# EAGLE design TCC (EAGLE 9.3.0)

## Sheet 1 of 6
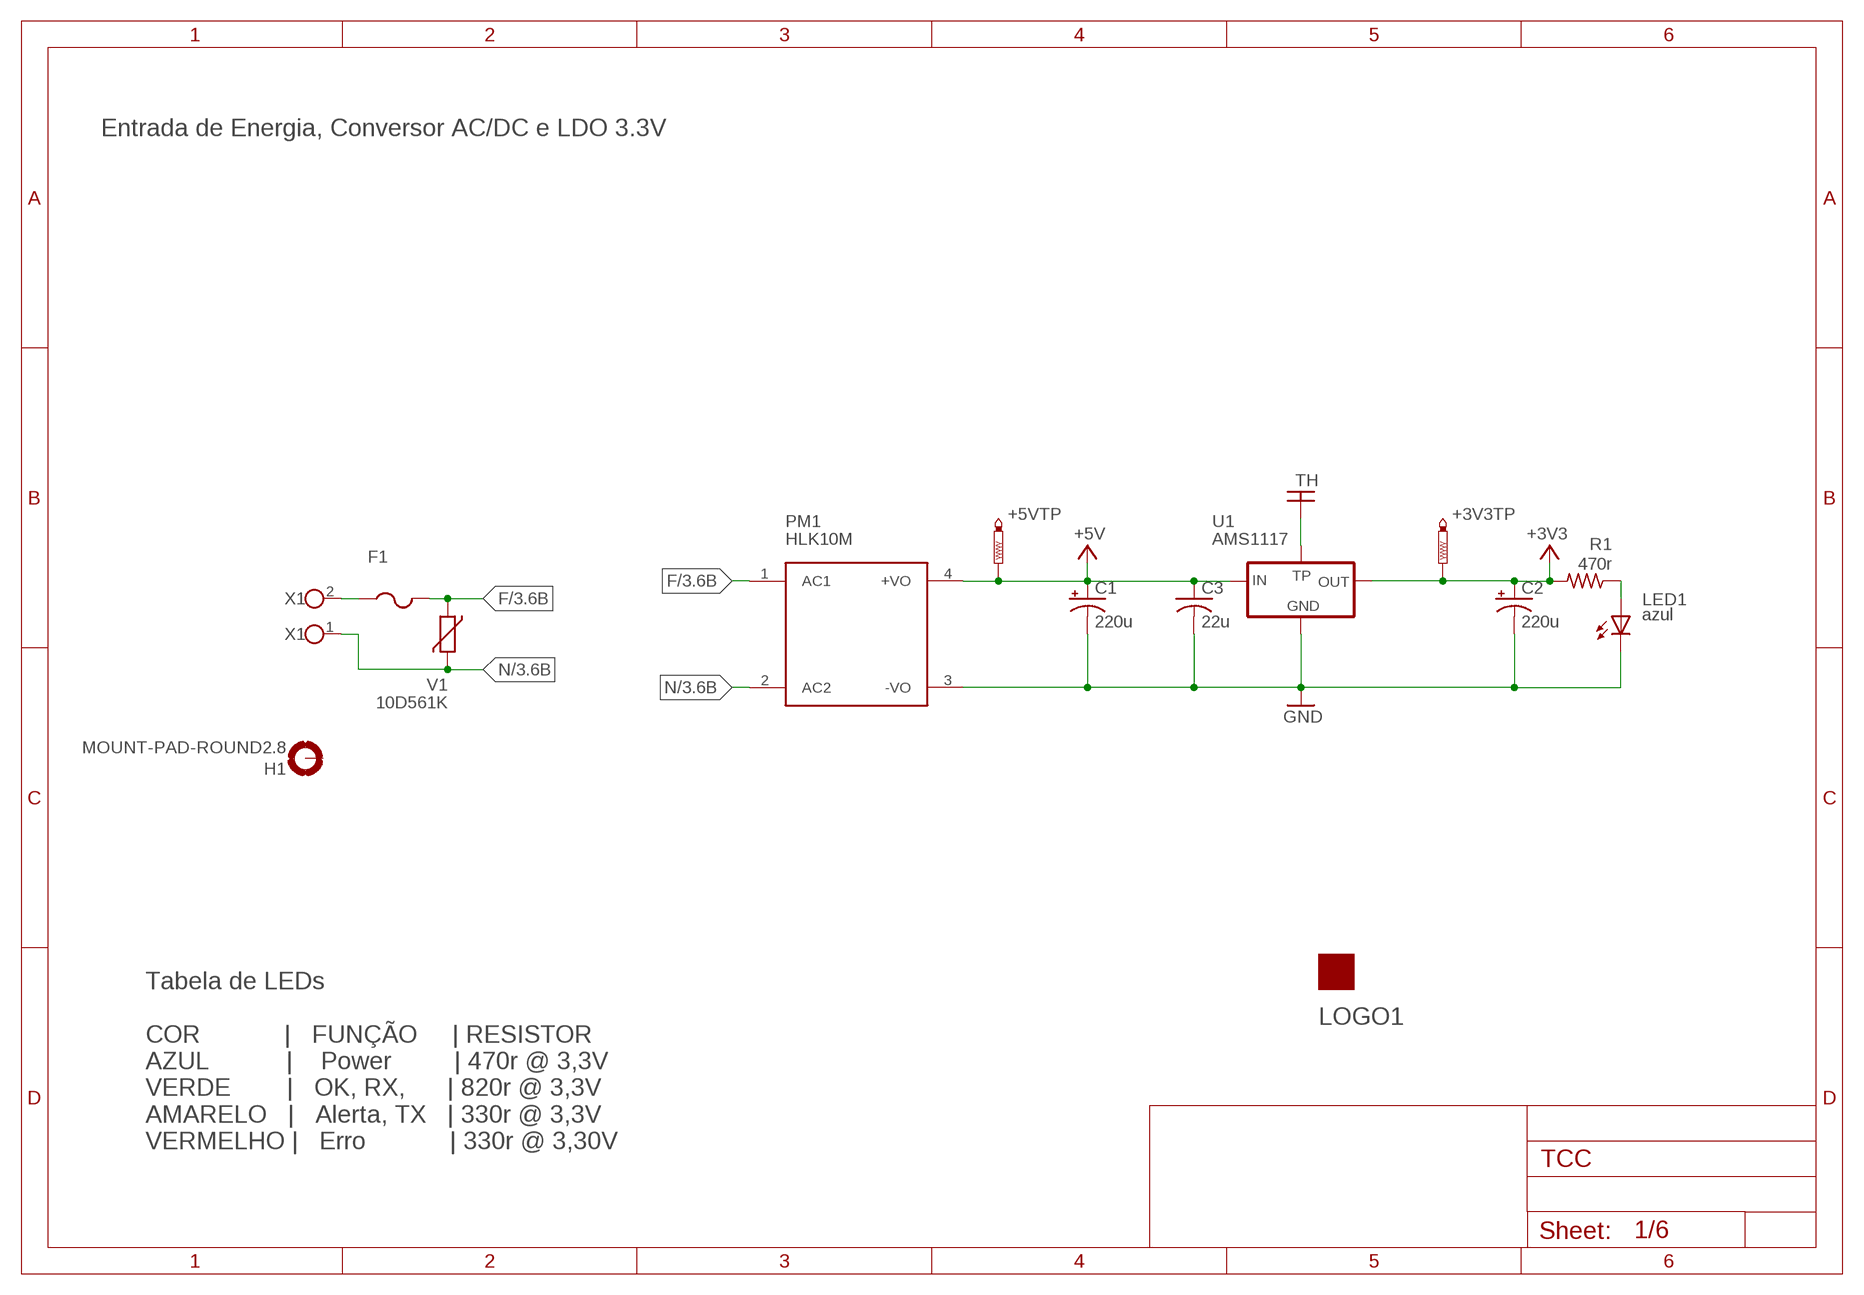
[diagram p0: schematic, sheet 1]

### Parts
+3V3TP  PTR1TP18R  [TP18R]
+5VTP  PTR1TP18R  [TP18R]
C1  220u  CPOL3.5/8  [E3,5-8]
C2  220u  CPOL3.5/8  [E3,5-8]
C3  22u  C0805  [C0805]
F1  FUSE  [SHK20L]
H1  MOUNT-PAD-ROUND2.8  [2,8-PAD]
LED1  azul  LED3MM  [LED3MM]
LOGO1  LOGOLOGO1  [LOGO_BRAZIL_FLAG]
PM1  HLK10M  [HLK-10M]
R1  470r  R0805  [R0805]
U1  AMS1117  [SOT223]
V1  10D561K  VARISTOR  [10D561K]
X1  TERM_BLOCK_2PBR1002V  [BR1002V]

### Nets
+3V3: +3V3TP.TP C2.+ R1.2 U1.2(OUT) ; also sheet 2,3,4,5,6
+5V: +5VTP.TP C1.+ C3.1 PM1.4(+VO) U1.3(IN) ; also sheet 3,6
F: F1.2A F1.2B PM1.1(AC1) V1.1 ; also sheet 3
GND: C1.- C2.- C3.2 LED1.K(C) PM1.3(-VO) U1.1(GND) ; also sheet 2,3,4,5,6
N: PM1.2(AC2) V1.2 X1.1 ; also sheet 3
N$1: F1.1A F1.1B X1.2
N$50: LED1.A R1.1
TH: U1.4(TP)
Unconnected: H1.B2,8(MOUNT)

### Notes on the sheet
- Entrada de Energia, Conversor AC/DC e LDO 3.3V
- Tabela de LEDs
  
  COR            |   FUNÇÃO     | RESISTOR
  AZUL           |    Power         | 470r @ 3,3V
  VERDE        |   OK, RX,      | 820r @ 3,3V
  AMARELO   |   Alerta, TX   | 330r @ 3,3V
  VERMELHO |   Erro            | 330r @ 3,30V

## Sheet 2 of 6
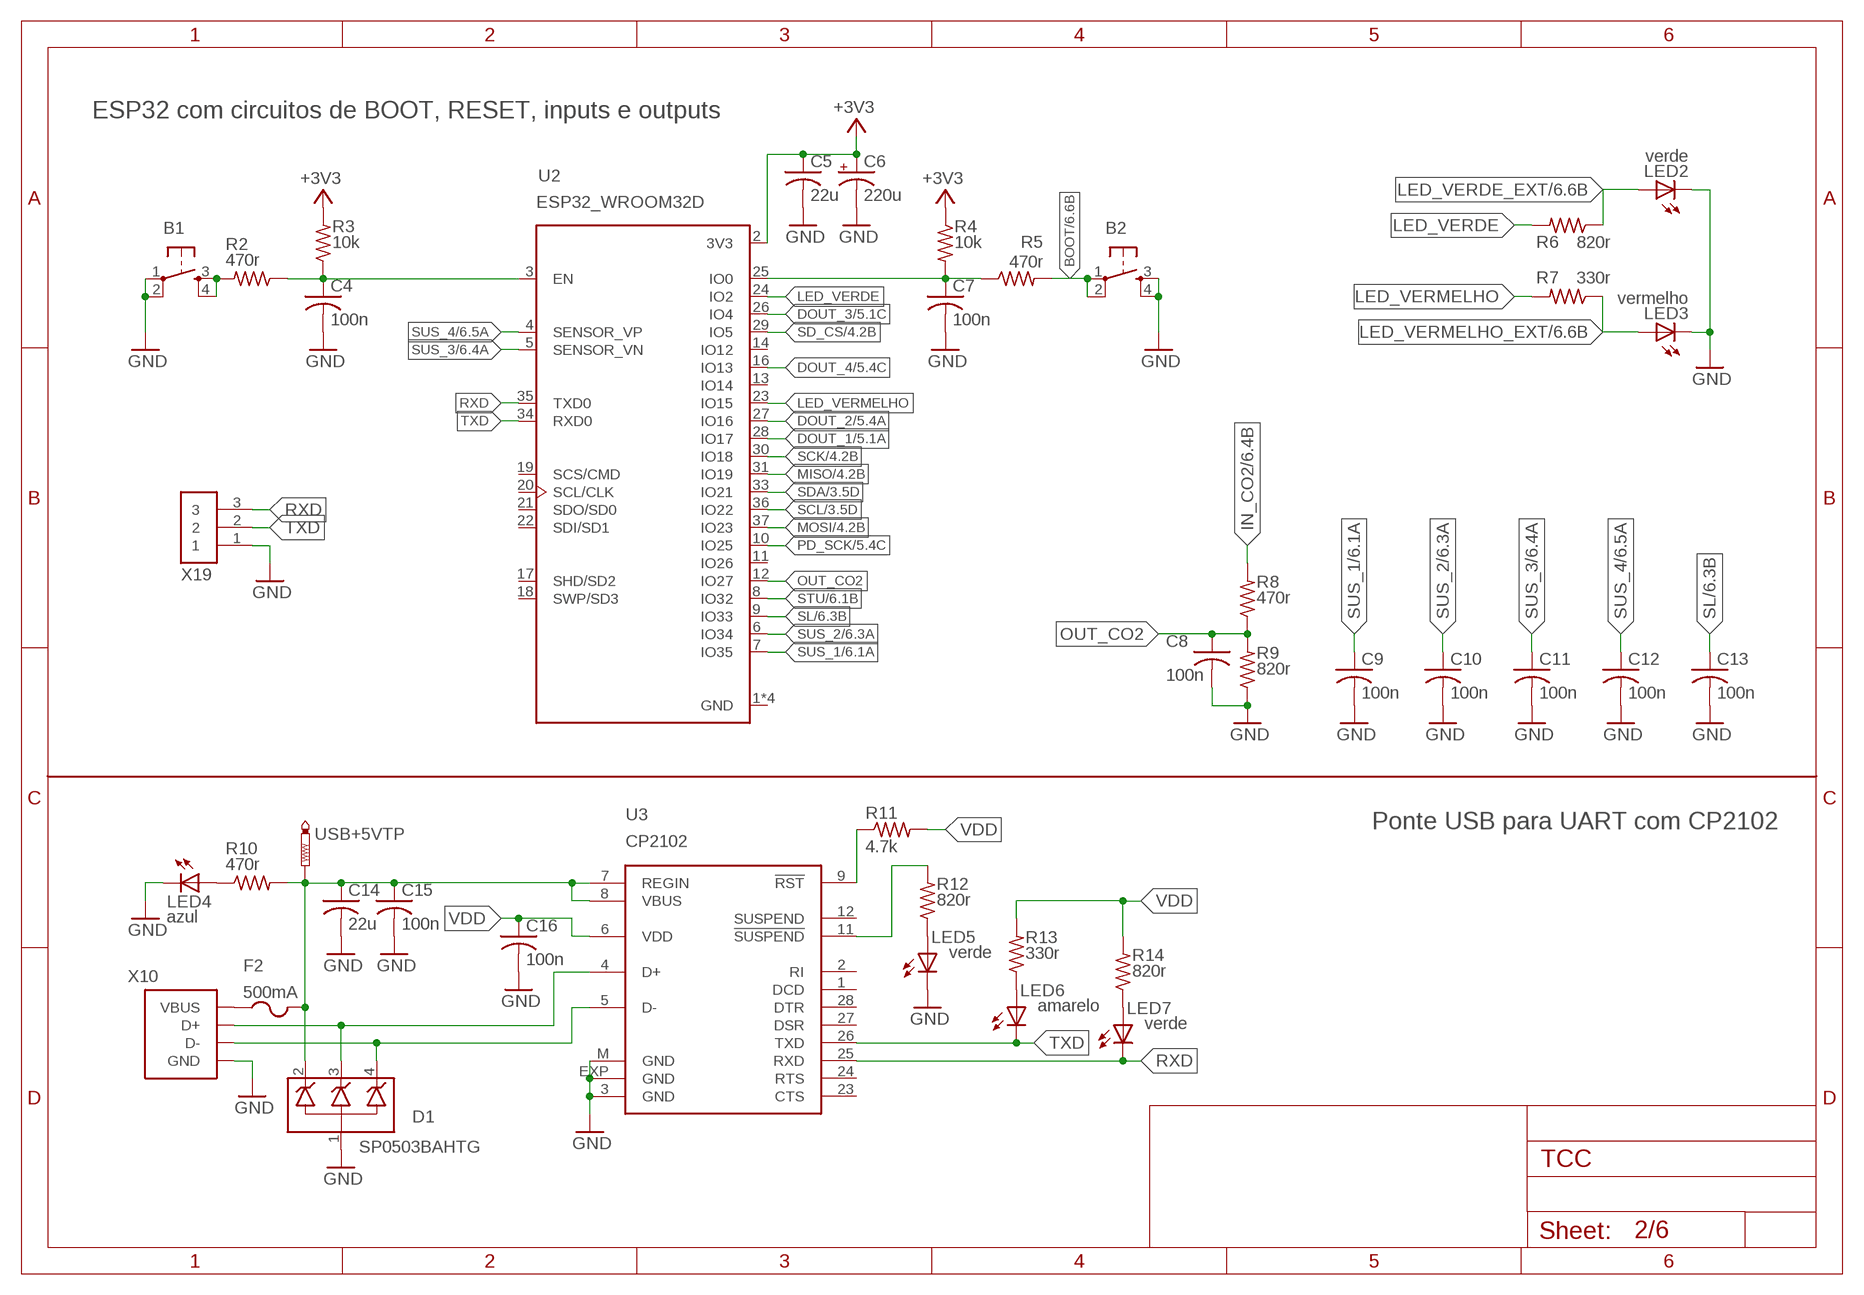
[diagram p1: schematic, sheet 2]

### Parts
B1  PUSHBUTTONTHT  [B3F-10XX]
B2  PUSHBUTTONTHT  [B3F-10XX]
C4  100n  C0805  [C0805]
C5  22u  C0805  [C0805]
C6  220u  CPOL3.5/8  [E3,5-8]
C7  100n  C0805  [C0805]
C8  100n  C0805  [C0805]
C9  100n  C0805  [C0805]
C10  100n  C0805  [C0805]
C11  100n  C0805  [C0805]
C12  100n  C0805  [C0805]
C13  100n  C0805  [C0805]
C14  22u  C0805  [C0805]
C15  100n  C0805  [C0805]
C16  100n  C0805  [C0805]
D1  SP0503BAHTG  TVS_3ARRAY  [SOT-143]
F2  500mA  PTC  [C0603]
LED2  verde  LED3MM  [LED3MM]
LED3  vermelho  LED3MM  [LED3MM]
LED4  azul  LED3MM  [LED3MM]
LED5  verde  LED3MM  [LED3MM]
LED6  amarelo  LED3MM  [LED3MM]
LED7  verde  LED3MM  [LED3MM]
R2  470r  R0805  [R0805]
R3  10k  R0805  [R0805]
R4  10k  R0805  [R0805]
R5  470r  R0805  [R0805]
R6  820r  R0805  [R0805]
R7  330r  R0805  [R0805]
R8  470r  R0805  [R0805]
R9  820r  R0805  [R0805]
R10  470r  R0805  [R0805]
R11  4.7k  R0805  [R0805]
R12  820r  R0805  [R0805]
R13  330r  R0805  [R0805]
R14  820r  R0805  [R0805]
U2  ESP32_WROOM32D  [MODULE_ESP32-WROOM]
U3  CP2102  [MLP28]
USB+5VTP  PTR1TP18R  [TP18R]
X10  USB_TYPEB_V  [USB-TYPEB-V]
X19  1X3  [1X3]

### Nets
+3V3: C5.1 C6.+ R3.2 R4.1 U2.2(3V3) ; also sheet 1,3,4,5,6
BOOT: B2.1 B2.2 R5.2 ; also sheet 6
DOUT_1: U2.28(IO17) ; also sheet 5
DOUT_2: U2.27(IO16) ; also sheet 5
DOUT_3: U2.26(IO4) ; also sheet 5
DOUT_4: U2.16(IO13) ; also sheet 5
GND: B1.1 B1.2 B2.3 B2.4 C4.2 C5.2 C6.- C7.2 C8.2 C9.2 C10.2 C11.2 C12.2 C13.2 C14.2 C15.2 C16.2 D1.1 LED2.K(C) LED3.K(C) LED4.K(C) LED5.K(C) R9.1 U3.3(GND) U3.EXP(GND) U3.M(GND) X10.GND X10.GND@1(GND) X10.GND@2(GND) X19.1 ; also sheet 1,3,4,5,6
IN_CO2: R8.2 ; also sheet 6
LED_VERDE: R6.2 U2.24(IO2)
LED_VERDE_EXT: LED2.A R6.1 ; also sheet 6
LED_VERMELHO: R7.2 U2.23(IO15)
LED_VERMELHO_EXT: LED3.A R7.1 ; also sheet 6
MISO: U2.31(IO19) ; also sheet 4
MOSI: U2.37(IO23) ; also sheet 4
N$5: C4.1 R2.1 R3.1 U2.3(EN)
N$11: B1.3 B1.4 R2.2
N$15: C7.1 R4.2 R5.1 U2.25(IO0)
N$21: C14.1 C15.1 D1.2 F2.2 R10.2 U3.7(REGIN) U3.8(VBUS) USB+5VTP.TP
N$30: LED4.A R10.1
N$36: F2.1 X10.VCC(VBUS)
N$42: R11.1 U3.9(!RST)
N$43: D1.3 U3.4(D+) X10.D+
N$46: D1.4 U3.5(D-) X10.D-
N$49: LED6.A R13.1
N$52: LED7.A R14.1
N$53: LED5.A R12.1
N$54: R12.2 U3.11(!SUSPEND)
OUT_CO2: C8.1 R8.1 R9.2 U2.12(IO27)
PD_SCK: U2.10(IO25) ; also sheet 5
RXD: LED7.K(C) U2.35(TXD0) U3.25(RXD) X19.3
SCK: U2.30(IO18) ; also sheet 4
SCL: U2.36(IO22) ; also sheet 3,4
SD_CS: U2.29(IO5) ; also sheet 4
SDA: U2.33(IO21) ; also sheet 3,4
SL: C13.1 U2.9(IO33) ; also sheet 6
STU: U2.8(IO32) ; also sheet 6
SUS_1: C9.1 U2.7(IO35) ; also sheet 6
SUS_2: C10.1 U2.6(IO34) ; also sheet 6
SUS_3: C11.1 U2.5(SENSOR_VN) ; also sheet 6
SUS_4: C12.1 U2.4(SENSOR_VP) ; also sheet 6
TXD: LED6.K(C) U2.34(RXD0) U3.26(TXD) X19.2
VDD: C16.1 R11.2 R13.2 R14.2 U3.6(VDD)
Unconnected: U2.11(IO26) U2.13(IO14) U2.14(IO12) U2.17(SHD/SD2) U2.18(SWP/SD3) U2.19(SCS/CMD) U2.20(SCL/CLK) U2.21(SDO/SD0) U2.22(SDI/SD1) U3.1(DCD) U3.2(RI) U3.12(SUSPEND) U3.23(CTS) U3.24(RTS) U3.27(DSR) U3.28(DTR)

### Notes on the sheet
- ESP32 com circuitos de BOOT, RESET, inputs e outputs
- Ponte USB para UART com CP2102

## Sheet 3 of 6
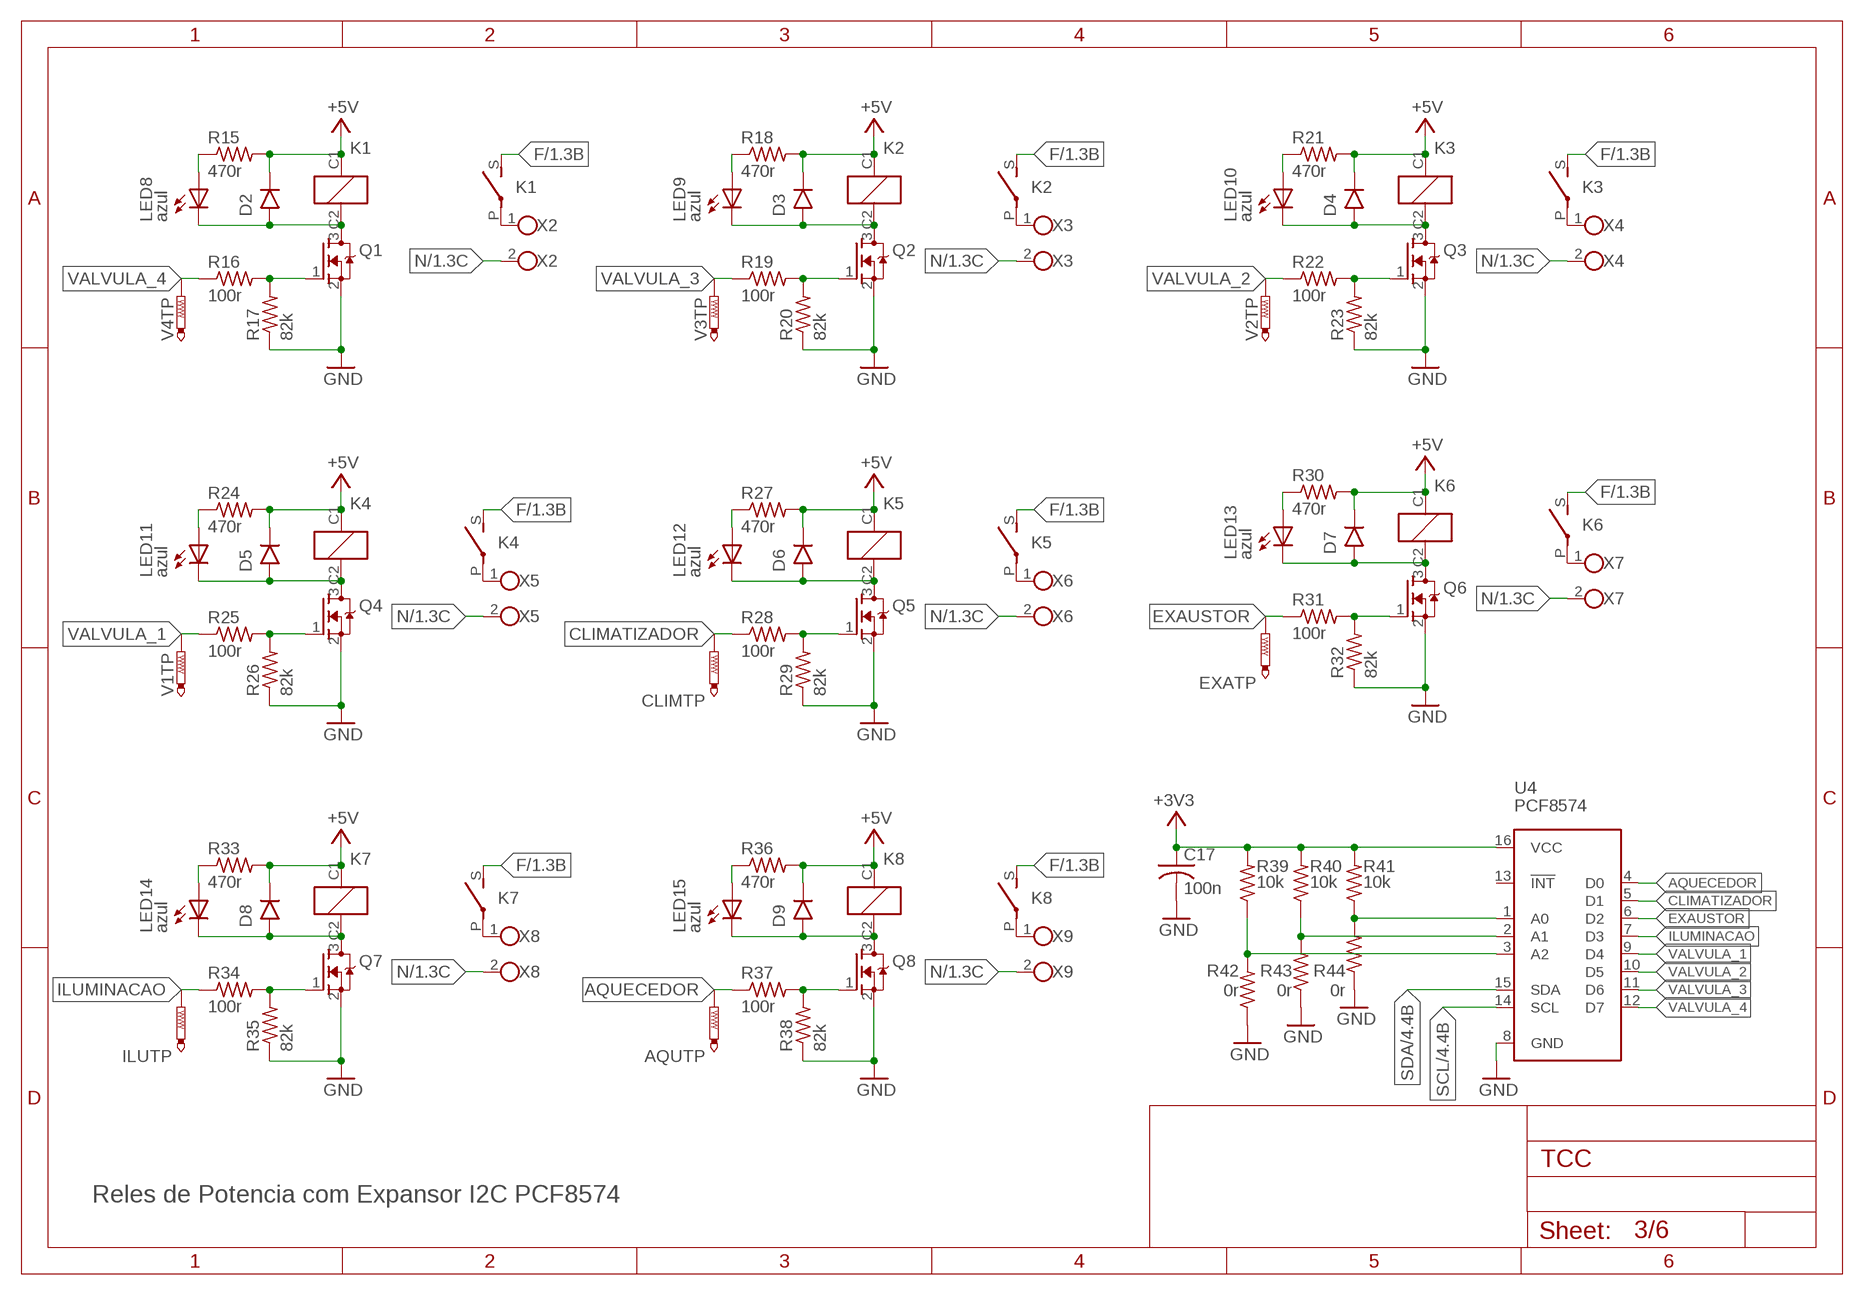
[diagram p2: schematic, sheet 3]

### Parts
AQUTP  PTR1TP18R  [TP18R]
C17  100n  C0805  [C0805]
CLIMTP  PTR1TP18R  [TP18R]
D2  DIODEM7  [SMA]
D3  DIODEM7  [SMA]
D4  DIODEM7  [SMA]
D5  DIODEM7  [SMA]
D6  DIODEM7  [SMA]
D7  DIODEM7  [SMA]
D8  DIODEM7  [SMA]
D9  DIODEM7  [SMA]
EXATP  PTR1TP18R  [TP18R]
ILUTP  PTR1TP18R  [TP18R]
K1  RELAY_SPST  [RC-105]
K2  RELAY_SPST  [RC-105]
K3  RELAY_SPST  [RC-105]
K4  RELAY_SPST  [RC-105]
K5  RELAY_SPST  [RC-105]
K6  RELAY_SPST  [RC-105]
K7  RELAY_SPST  [RC-105]
K8  RELAY_SPST  [RC-105]
LED8  azul  LED3MM  [LED3MM]
LED9  azul  LED3MM  [LED3MM]
LED10  azul  LED3MM  [LED3MM]
LED11  azul  LED3MM  [LED3MM]
LED12  azul  LED3MM  [LED3MM]
LED13  azul  LED3MM  [LED3MM]
LED14  azul  LED3MM  [LED3MM]
LED15  azul  LED3MM  [LED3MM]
Q1  MOSFET-NBSS138  [SOT23]
Q2  MOSFET-NBSS138  [SOT23]
Q3  MOSFET-NBSS138  [SOT23]
Q4  MOSFET-NBSS138  [SOT23]
Q5  MOSFET-NBSS138  [SOT23]
Q6  MOSFET-NBSS138  [SOT23]
Q7  MOSFET-NBSS138  [SOT23]
Q8  MOSFET-NBSS138  [SOT23]
R15  470r  R0805  [R0805]
R16  100r  R0805  [R0805]
R17  82k  R0805  [R0805]
R18  470r  R0805  [R0805]
R19  100r  R0805  [R0805]
R20  82k  R0805  [R0805]
R21  470r  R0805  [R0805]
R22  100r  R0805  [R0805]
R23  82k  R0805  [R0805]
R24  470r  R0805  [R0805]
R25  100r  R0805  [R0805]
R26  82k  R0805  [R0805]
R27  470r  R0805  [R0805]
R28  100r  R0805  [R0805]
R29  82k  R0805  [R0805]
R30  470r  R0805  [R0805]
R31  100r  R0805  [R0805]
R32  82k  R0805  [R0805]
R33  470r  R0805  [R0805]
R34  100r  R0805  [R0805]
R35  82k  R0805  [R0805]
R36  470r  R0805  [R0805]
R37  100r  R0805  [R0805]
R38  82k  R0805  [R0805]
R39  10k  R0805  [R0805]
R40  10k  R0805  [R0805]
R41  10k  R0805  [R0805]
R42  0r  R0805  [R0805]
R43  0r  R0805  [R0805]
R44  0r  R0805  [R0805]
U4  PCF8574  [SOIC16_W]
V1TP  PTR1TP18R  [TP18R]
V2TP  PTR1TP18R  [TP18R]
V3TP  PTR1TP18R  [TP18R]
V4TP  PTR1TP18R  [TP18R]
X2  TERM_BLOCK_2PBR1002V  [BR1002V]
X3  TERM_BLOCK_2PBR1002V  [BR1002V]
X4  TERM_BLOCK_2PBR1002V  [BR1002V]
X5  TERM_BLOCK_2PBR1002V  [BR1002V]
X6  TERM_BLOCK_2PBR1002V  [BR1002V]
X7  TERM_BLOCK_2PBR1002V  [BR1002V]
X8  TERM_BLOCK_2PBR1002V  [BR1002V]
X9  TERM_BLOCK_2PBR1002V  [BR1002V]

### Nets
+3V3: C17.1 R39.2 R40.2 R41.2 U4.16(VCC) ; also sheet 1,2,4,5,6
+5V: D2.C D3.C D4.C D5.C D6.C D7.C D8.C D9.C K1.C1 K2.C1 K3.C1 K4.C1 K5.C1 K6.C1 K7.C1 K8.C1 R15.2 R18.2 R21.2 R24.2 R27.2 R30.2 R33.2 R36.2 ; also sheet 1,6
AQUECEDOR: AQUTP.TP R37.1 U4.4(D0)
CLIMATIZADOR: CLIMTP.TP R28.1 U4.5(D1)
EXAUSTOR: EXATP.TP R31.1 U4.6(D2)
F: K1.S K2.S K3.S K4.S K5.S K6.S K7.S K8.S ; also sheet 1
GND: C17.2 Q1.2(S) Q2.2(S) Q3.2(S) Q4.2(S) Q5.2(S) Q6.2(S) Q7.2(S) Q8.2(S) R17.1 R20.1 R23.1 R26.1 R29.1 R32.1 R35.1 R38.1 R42.1 R43.1 R44.1 U4.8(GND) ; also sheet 1,2,4,5,6
ILUMINACAO: ILUTP.TP R34.1 U4.7(D3)
N: X2.2 X3.2 X4.2 X5.2 X6.2 X7.2 X8.2 X9.2 ; also sheet 1
N$2: D2.A K1.C2 LED8.K(C) Q1.3(D)
N$3: LED8.A R15.1
N$4: Q1.1(G) R16.2 R17.2
N$6: K8.P X9.1
N$7: D3.A K2.C2 LED9.K(C) Q2.3(D)
N$8: Q2.1(G) R19.2 R20.2
N$9: LED9.A R18.1
N$10: K1.P X2.1
N$12: D4.A K3.C2 LED10.K(C) Q3.3(D)
N$13: Q3.1(G) R22.2 R23.2
N$14: LED10.A R21.1
N$16: K2.P X3.1
N$17: D5.A K4.C2 LED11.K(C) Q4.3(D)
N$18: Q4.1(G) R25.2 R26.2
N$19: LED11.A R24.1
N$20: K3.P X4.1
N$22: D6.A K5.C2 LED12.K(C) Q5.3(D)
N$23: Q5.1(G) R28.2 R29.2
N$24: LED12.A R27.1
N$25: K4.P X5.1
N$27: D7.A K6.C2 LED13.K(C) Q6.3(D)
N$28: Q6.1(G) R31.2 R32.2
N$29: LED13.A R30.1
N$31: K5.P X6.1
N$32: D8.A K7.C2 LED14.K(C) Q7.3(D)
N$33: Q7.1(G) R34.2 R35.2
N$34: LED14.A R33.1
N$35: K6.P X7.1
N$37: D9.A K8.C2 LED15.K(C) Q8.3(D)
N$38: Q8.1(G) R37.2 R38.2
N$39: LED15.A R36.1
N$40: K7.P X8.1
N$58: R41.1 R44.2 U4.1(A0)
N$59: R40.1 R43.2 U4.2(A1)
N$60: R39.1 R42.2 U4.3(A2)
SCL: U4.14(SCL) ; also sheet 2,4
SDA: U4.15(SDA) ; also sheet 2,4
VALVULA_1: R25.1 U4.9(D4) V1TP.TP
VALVULA_2: R22.1 U4.10(D5) V2TP.TP
VALVULA_3: R19.1 U4.11(D6) V3TP.TP
VALVULA_4: R16.1 U4.12(D7) V4TP.TP
Unconnected: U4.13(!INT)

### Notes on the sheet
- Reles de Potencia com Expansor I2C PCF8574

## Sheet 4 of 6
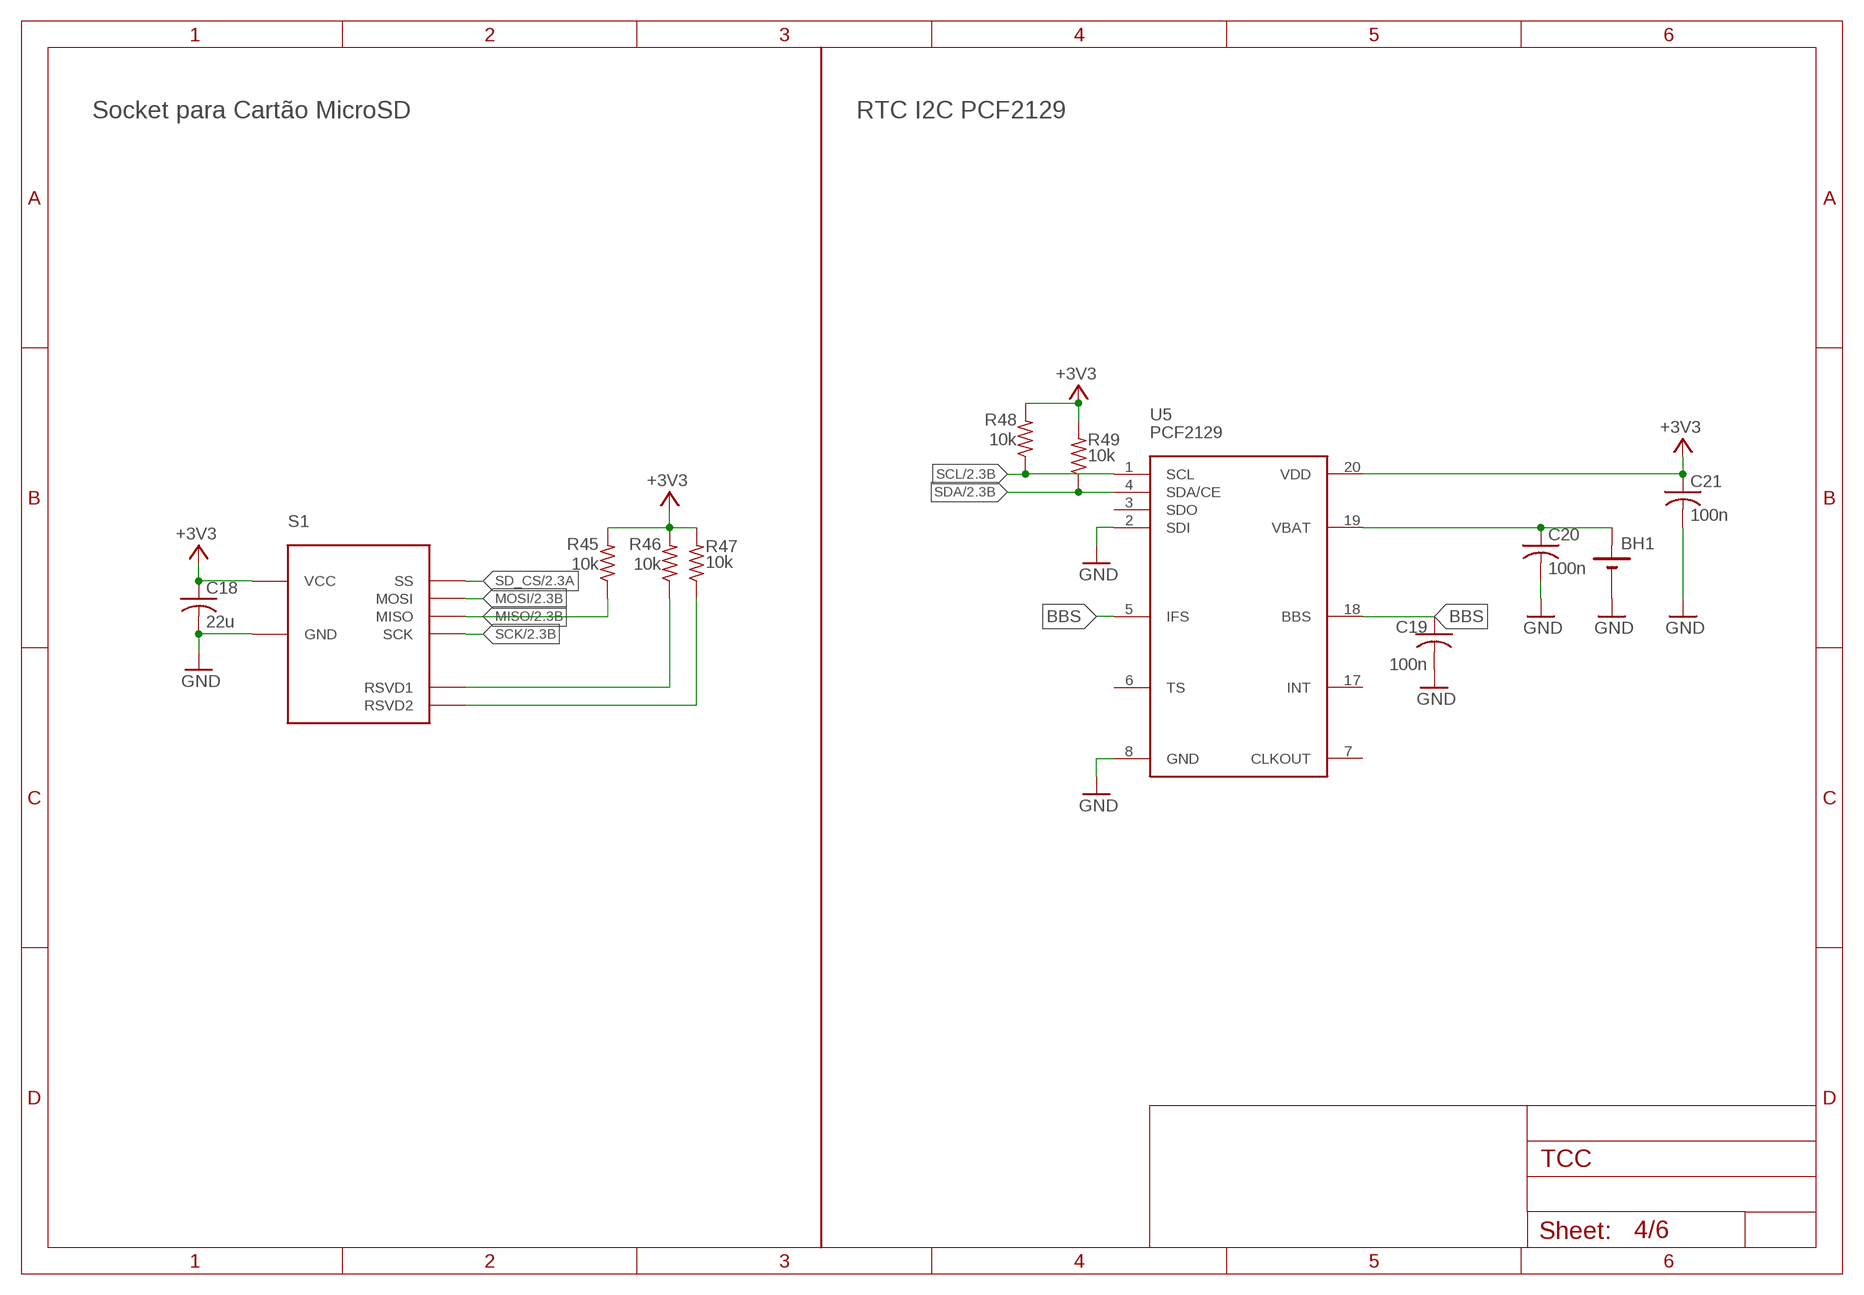
[diagram p3: schematic, sheet 4]

### Parts
BH1  CR2032  [BAT_BS-7]
C18  22u  C0805  [C0805]
C19  100n  C0805  [C0805]
C20  100n  C0805  [C0805]
C21  100n  C0805  [C0805]
R45  10k  R0805  [R0805]
R46  10k  R0805  [R0805]
R47  10k  R0805  [R0805]
R48  10k  R0805  [R0805]
R49  10k  R0805  [R0805]
S1  MICROSDSOCKETTF-002T-15  [TF-002T-15]
U5  PCF2129  [SOIC127P1032X264-20N]

### Nets
+3V3: C18.1 C21.1 R45.2 R46.2 R47.2 R48.2 R49.2 S1.VDD(VCC) U5.20(VDD) ; also sheet 1,2,3,5,6
BBS: C19.1 U5.5(IFS) U5.18(BBS)
GND: BH1.- C18.2 C19.2 C20.2 C21.2 S1.GND S1.PAD@1(GND) S1.PAD@2(GND) S1.PAD@3(GND) S1.PAD@4(GND) U5.2(SDI) U5.8(GND) ; also sheet 1,2,3,5,6
MISO: R45.1 S1.MISO ; also sheet 2
MOSI: S1.MOSI ; also sheet 2
N$51: R46.1 S1.RES@1(RSVD1)
N$55: R47.1 S1.RES@2(RSVD2)
N$56: BH1.+ C20.1 U5.19(VBAT)
SCK: S1.SCK ; also sheet 2
SCL: R48.1 U5.1(SCL) ; also sheet 2,3
SD_CS: S1.CS(SS) ; also sheet 2
SDA: R49.1 U5.4(SDA/CE) ; also sheet 2,3
Unconnected: U5.3(SDO) U5.6(TS) U5.7(CLKOUT) U5.17(INT)

### Notes on the sheet
- Socket para Cartão MicroSD | RTC I2C PCF2129

## Sheet 5 of 6
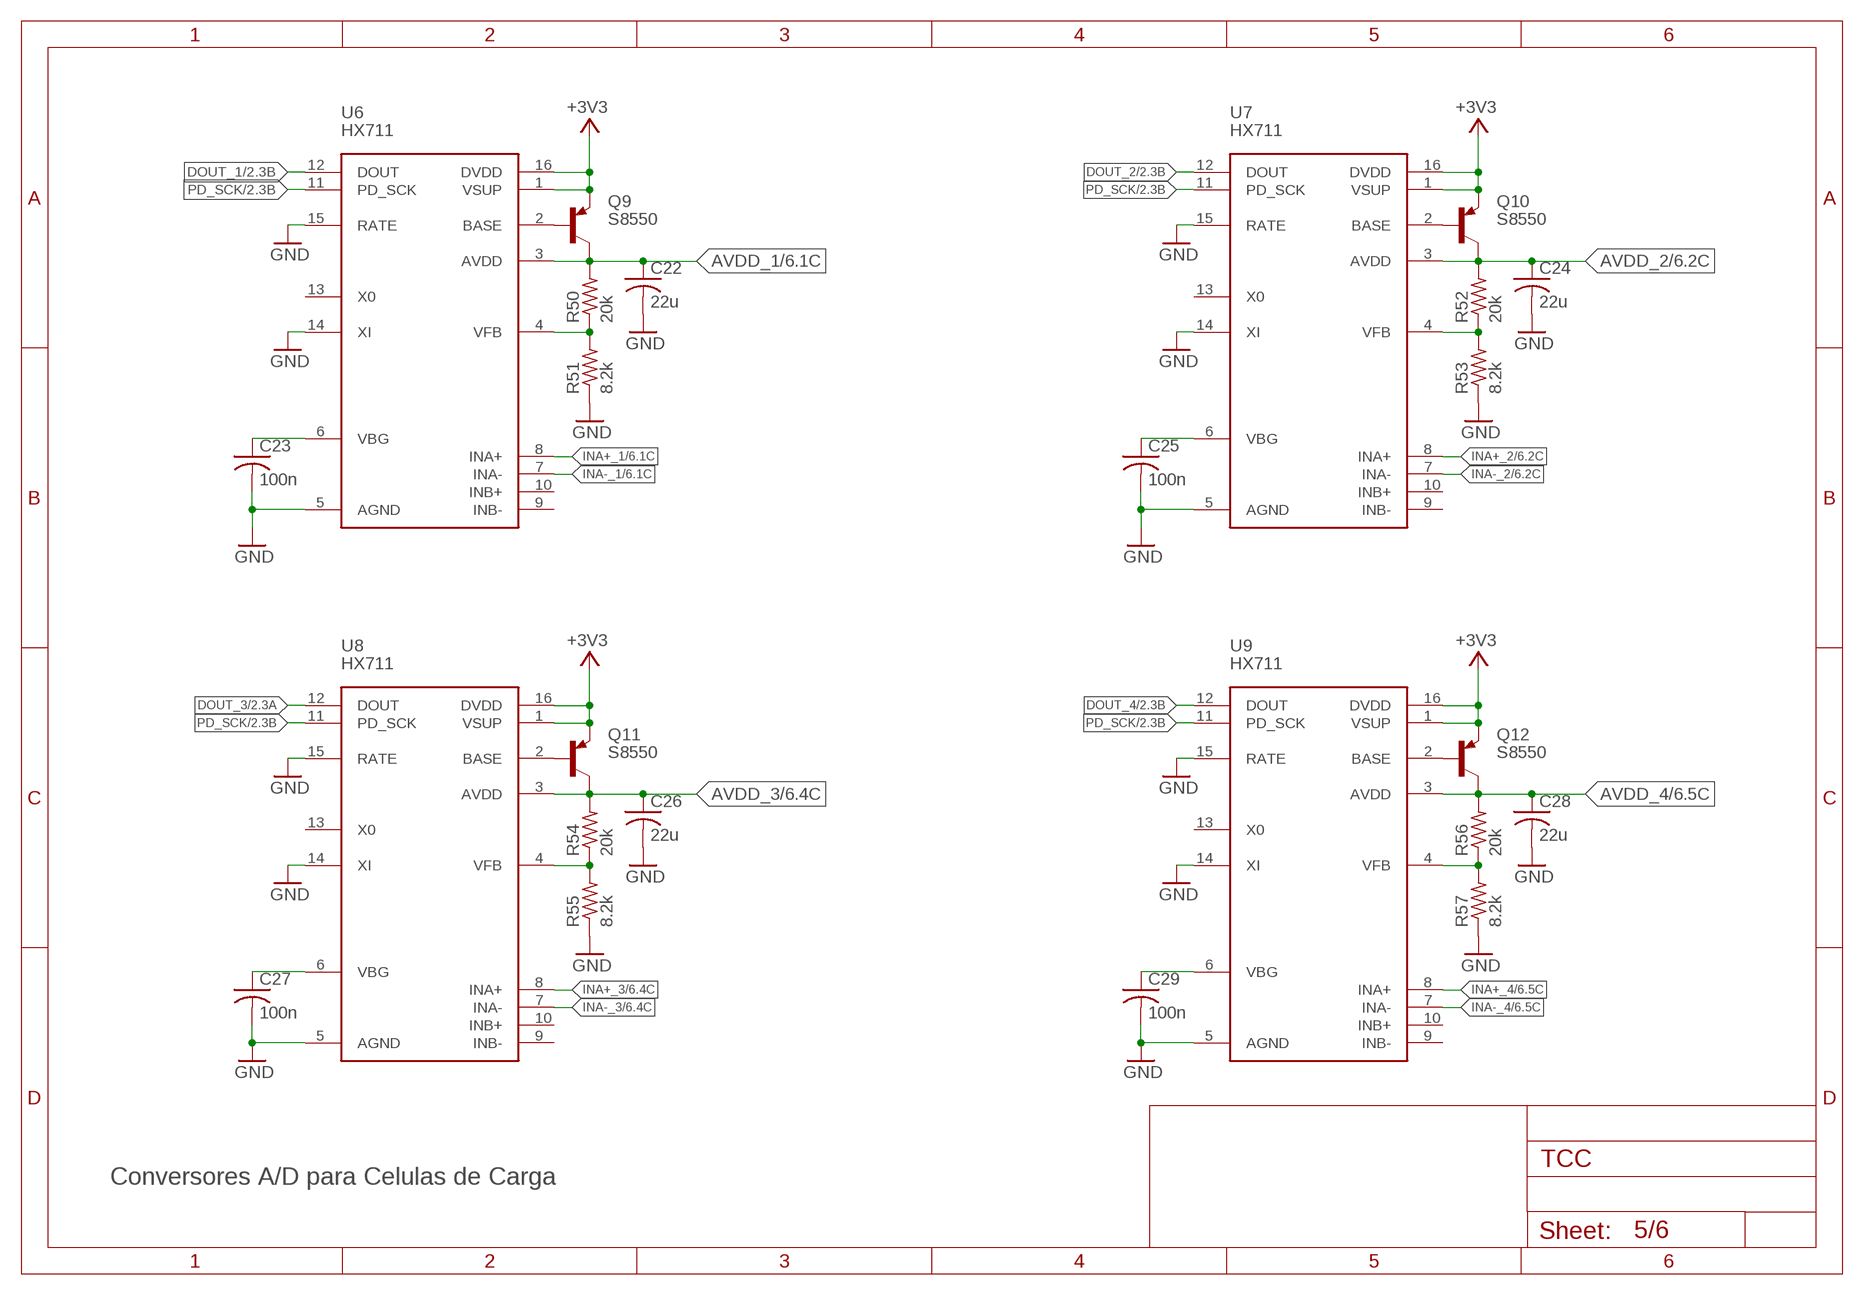
[diagram p4: schematic, sheet 5]

### Parts
C22  22u  C0805  [C0805]
C23  100n  C0805  [C0805]
C24  22u  C0805  [C0805]
C25  100n  C0805  [C0805]
C26  22u  C0805  [C0805]
C27  100n  C0805  [C0805]
C28  22u  C0805  [C0805]
C29  100n  C0805  [C0805]
Q9  S8550  PNP  [SOT23]
Q10  S8550  PNP  [SOT23]
Q11  S8550  PNP  [SOT23]
Q12  S8550  PNP  [SOT23]
R50  20k  R0805  [R0805]
R51  8.2k  R0805  [R0805]
R52  20k  R0805  [R0805]
R53  8.2k  R0805  [R0805]
R54  20k  R0805  [R0805]
R55  8.2k  R0805  [R0805]
R56  20k  R0805  [R0805]
R57  8.2k  R0805  [R0805]
U6  HX711  [SOP16]
U7  HX711  [SOP16]
U8  HX711  [SOP16]
U9  HX711  [SOP16]

### Nets
+3V3: Q9.2(E) Q10.2(E) Q11.2(E) Q12.2(E) U6.1(VSUP) U6.16(DVDD) U7.1(VSUP) U7.16(DVDD) U8.1(VSUP) U8.16(DVDD) U9.1(VSUP) U9.16(DVDD) ; also sheet 1,2,3,4,6
AVDD_1: C22.1 Q9.3(C) R50.2 U6.3(AVDD) ; also sheet 6
AVDD_2: C24.1 Q10.3(C) R52.2 U7.3(AVDD) ; also sheet 6
AVDD_3: C26.1 Q11.3(C) R54.2 U8.3(AVDD) ; also sheet 6
AVDD_4: C28.1 Q12.3(C) R56.2 U9.3(AVDD) ; also sheet 6
DOUT_1: U6.12(DOUT) ; also sheet 2
DOUT_2: U7.12(DOUT) ; also sheet 2
DOUT_3: U8.12(DOUT) ; also sheet 2
DOUT_4: U9.12(DOUT) ; also sheet 2
GND: C22.2 C23.2 C24.2 C25.2 C26.2 C27.2 C28.2 C29.2 R51.1 R53.1 R55.1 R57.1 U6.5(AGND) U6.14(XI) U6.15(RATE) U7.5(AGND) U7.14(XI) U7.15(RATE) U8.5(AGND) U8.14(XI) U8.15(RATE) U9.5(AGND) U9.14(XI) U9.15(RATE) ; also sheet 1,2,3,4,6
INA+_1: U6.8(INA+) ; also sheet 6
INA+_2: U7.8(INA+) ; also sheet 6
INA+_3: U8.8(INA+) ; also sheet 6
INA+_4: U9.8(INA+) ; also sheet 6
INA-_1: U6.7(INA-) ; also sheet 6
INA-_2: U7.7(INA-) ; also sheet 6
INA-_3: U8.7(INA-) ; also sheet 6
INA-_4: U9.7(INA-) ; also sheet 6
N$26: Q9.1(B) U6.2(BASE)
N$41: R50.1 R51.2 U6.4(VFB)
N$64: Q10.1(B) U7.2(BASE)
N$66: C23.1 U6.6(VBG)
N$67: R52.1 R53.2 U7.4(VFB)
N$74: C25.1 U7.6(VBG)
N$75: Q11.1(B) U8.2(BASE)
N$77: R54.1 R55.2 U8.4(VFB)
N$84: C27.1 U8.6(VBG)
N$85: Q12.1(B) U9.2(BASE)
N$87: R56.1 R57.2 U9.4(VFB)
N$94: C29.1 U9.6(VBG)
PD_SCK: U6.11(PD_SCK) U7.11(PD_SCK) U8.11(PD_SCK) U9.11(PD_SCK) ; also sheet 2
Unconnected: U6.9(INB-) U6.10(INB+) U6.13(X0) U7.9(INB-) U7.10(INB+) U7.13(X0) U8.9(INB-) U8.10(INB+) U8.13(X0) U9.9(INB-) U9.10(INB+) U9.13(X0)

### Notes on the sheet
- Conversores A/D para Celulas de Carga

## Sheet 6 of 6
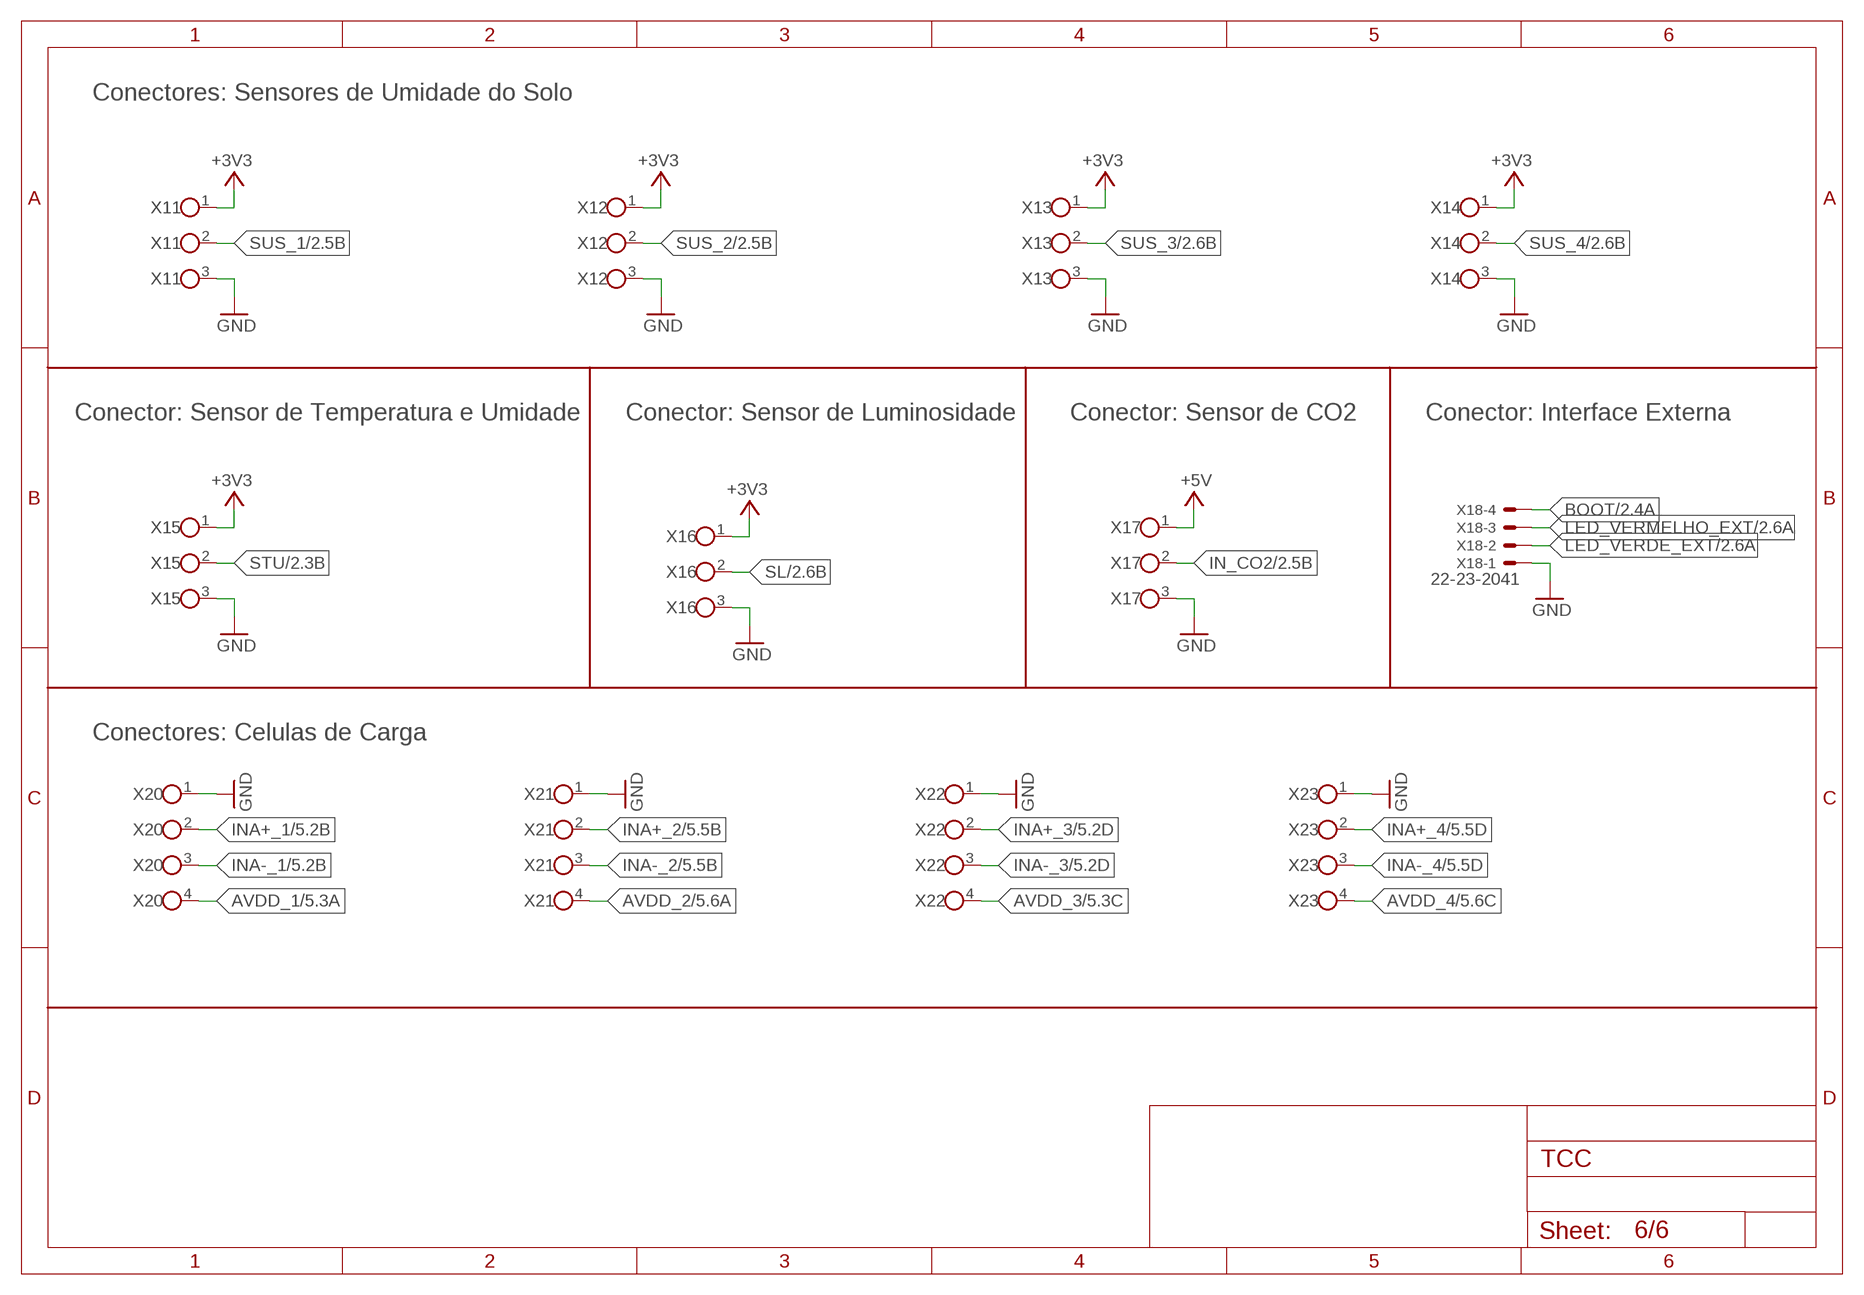
[diagram p5: schematic, sheet 6]

### Parts
X11  TERM_BLOCK_3P  [TE_1-2834011-3]
X12  TERM_BLOCK_3P  [TE_1-2834011-3]
X13  TERM_BLOCK_3P  [TE_1-2834011-3]
X14  TERM_BLOCK_3P  [TE_1-2834011-3]
X15  TERM_BLOCK_3P  [TE_1-2834011-3]
X16  TERM_BLOCK_3P  [TE_1-2834011-3]
X17  TERM_BLOCK_3P  [TE_1-2834011-3]
X18  22-23-2041  [22-23-2041]
X20  TERM_BLOCK_4P  [TE_1-2834011-4]
X21  TERM_BLOCK_4P  [TE_1-2834011-4]
X22  TERM_BLOCK_4P  [TE_1-2834011-4]
X23  TERM_BLOCK_4P  [TE_1-2834011-4]

### Nets
+3V3: X11.1 X12.1 X13.1 X14.1 X15.1 X16.1 ; also sheet 1,2,3,4,5
+5V: X17.1 ; also sheet 1,3
AVDD_1: X20.4 ; also sheet 5
AVDD_2: X21.4 ; also sheet 5
AVDD_3: X22.4 ; also sheet 5
AVDD_4: X23.4 ; also sheet 5
BOOT: X18.4 ; also sheet 2
GND: X11.3 X12.3 X13.3 X14.3 X15.3 X16.3 X17.3 X18.1 X20.1 X21.1 X22.1 X23.1 ; also sheet 1,2,3,4,5
IN_CO2: X17.2 ; also sheet 2
INA+_1: X20.2 ; also sheet 5
INA+_2: X21.2 ; also sheet 5
INA+_3: X22.2 ; also sheet 5
INA+_4: X23.2 ; also sheet 5
INA-_1: X20.3 ; also sheet 5
INA-_2: X21.3 ; also sheet 5
INA-_3: X22.3 ; also sheet 5
INA-_4: X23.3 ; also sheet 5
LED_VERDE_EXT: X18.2 ; also sheet 2
LED_VERMELHO_EXT: X18.3 ; also sheet 2
SL: X16.2 ; also sheet 2
STU: X15.2 ; also sheet 2
SUS_1: X11.2 ; also sheet 2
SUS_2: X12.2 ; also sheet 2
SUS_3: X13.2 ; also sheet 2
SUS_4: X14.2 ; also sheet 2

### Notes on the sheet
- Conectores: Sensores de Umidade do Solo
- Conector: Sensor de Temperatura e Umidade | Conector: Sensor de Luminosidade | Conector: Sensor de CO2 | Conector: Interface Externa
- Conectores: Celulas de Carga

## Power pins joined to a net without a drawn wire
GND: U2.1(GND) U2.15(GND) U2.38(GND) U2.39(GND)

## Library data of the parts
+3V3TP +5VTP AQUTP CLIMTP EXATP ILUTP USB+5VTP V1TP V2TP V3TP V4TP = testpad:PTR1: TEST PIN
B1 B2 = Electromechanical:PUSHBUTTON: Pushbutton; PN: B3F-1000
BH1 = Connectors:CR2032: CR2032 Battery Holder; PN: BS-2-1
C1 C2 C6 = Basics_SMD:CPOL: Polarized Capacitor CPol; PN: 220uF/35V
C3 C5 C14 C18 C22 C24 C26 C28 = Basics_SMD:C: Capacitor; PN: CL21A226MAQNNNE
C4 C7-C13 C15-C17 C19-C21 C23 C25 C27 C29 = Basics_SMD:C: Capacitor; PN: C0805C104K5RAC7800
D1 = Semiconductors_SMD:TVS_3ARRAY: TVS Array SP0503BAHTG; PN: SP0503BAHTG
D2-D9 = Semiconductors_SMD:DIODE: Diode; PN: M7
F1 = Connectors:FUSE: Fuse Holder 5x20; PN: LS-502
F2 = Basics_SMD:PTC: PTC Resettable Fuse; PN: MF-FSMF020X-2
H1 = holes:MOUNT-PAD-ROUND: MOUNTING PAD, round
K1-K8 = Electromechanical:RELAY_SPST: Relay SPST; PN: RC-105DM1
LED1-LED15 = Semiconductors_SMD:LED: LED
LOGO1 = LOGO:LOGO: LOGO
PM1 = HiLink:HLK10M: AC/DC Power Module HLK-10M; PN: HLK-10M05
Q1-Q8 = Semiconductors_SMD:MOSFET-N: Mosfet N-channel; PN: BSS138
Q9-Q12 = Semiconductors_SMD:PNP: PNP Transistor; PN: S8550
R1 R2 R5 R8 R10 R15 R18 R21 R24 R27 R30 R33 R36 = Basics_SMD:R: Resistor; PN: RC0805FR-07470RL
R3 R4 R39-R41 R45-R49 = Basics_SMD:R: Resistor; PN: RC0805FR-0710KL
R6 R9 R12 R14 = Basics_SMD:R: Resistor; PN: RC0805FR-07820RL
R7 R13 = Basics_SMD:R: Resistor; PN: RC0805FR-07330RL
R11 = Basics_SMD:R: Resistor; PN: RC0805FR-074K7L
R16 R19 R22 R25 R28 R31 R34 R37 = Basics_SMD:R: Resistor; PN: RC0805FR-07100RL
R17 R20 R23 R26 R29 R32 R35 R38 = Basics_SMD:R: Resistor; PN: RC0805FR-0782KL
R42-R44 = Basics_SMD:R: Resistor; PN: RC0805JR-070RL
R50 R52 R54 R56 = Basics_SMD:R: Resistor; PN: RC0805FR-0720KL
R51 R53 R55 R57 = Basics_SMD:R: Resistor; PN: RC0805FR-078K2L
S1 = Connectors:MICROSDSOCKET: Micro SD card socket; PN: TF-002T-15
U1 = Semiconductors_SMD:AMS1117: voltage Regulator LDO AMS1117; PN: AMS1117-3.3
U2 = Espressif_Systems:ESP32_WROOM: ESP32; PN: ESP32-WROOM-32D
U3 = silabs:CP210*: Single-Chip USB to UART Bridge Source: www.silabs.com .. CP2101.pdf / cp2102.pdf; MF: FARNELL; MPN: CP2102-GM; OC_FARNELL: 9282130; OC_NEWARK: 30K5635; PN: CP2102-GMR
U4 = Texas_Instruments:PCF8574: I2C 8bit I/O Expander PCF8574; PN: PCF8574T/3,518
U5 = NXP:PCF2129: RTC PCF2129; PN: PCF2129AT/2,518
U6-U9 = Chinese Semiconductors:HX711: HX711 24-bit ADC for Load Cell; PN: HX711
V1 = Basics_SMD:VARISTOR: Varistor; PN: 10D561K
X1-X8 = Connectors:TERM_BLOCK_2P: Terminal block 2 position; PN: BR1002V
X9 = Connectors:TERM_BLOCK_2P: Terminal block 2 position
X10 = Connectors:USB_TYPEB_V: USB Type-B Vertical; PN: C26234
X11-X17 = Connectors:TERM_BLOCK_3P: Terminal block 3 position; PN: KF250-3.5-3P-2
X18 = con-molex:22-23-2041: .100" (2.54mm) Center Header - 4 Pin; MF: MOLEX; MPN: 22-23-2041; OC_FARNELL: 1462920; OC_NEWARK: 38C0355
X19 = Daniel_lib:1X3: Pin header 1x3
X20-X23 = Connectors:TERM_BLOCK_4P: Terminal block 4 position; PN: KF250-3.5-4P-1

## Board
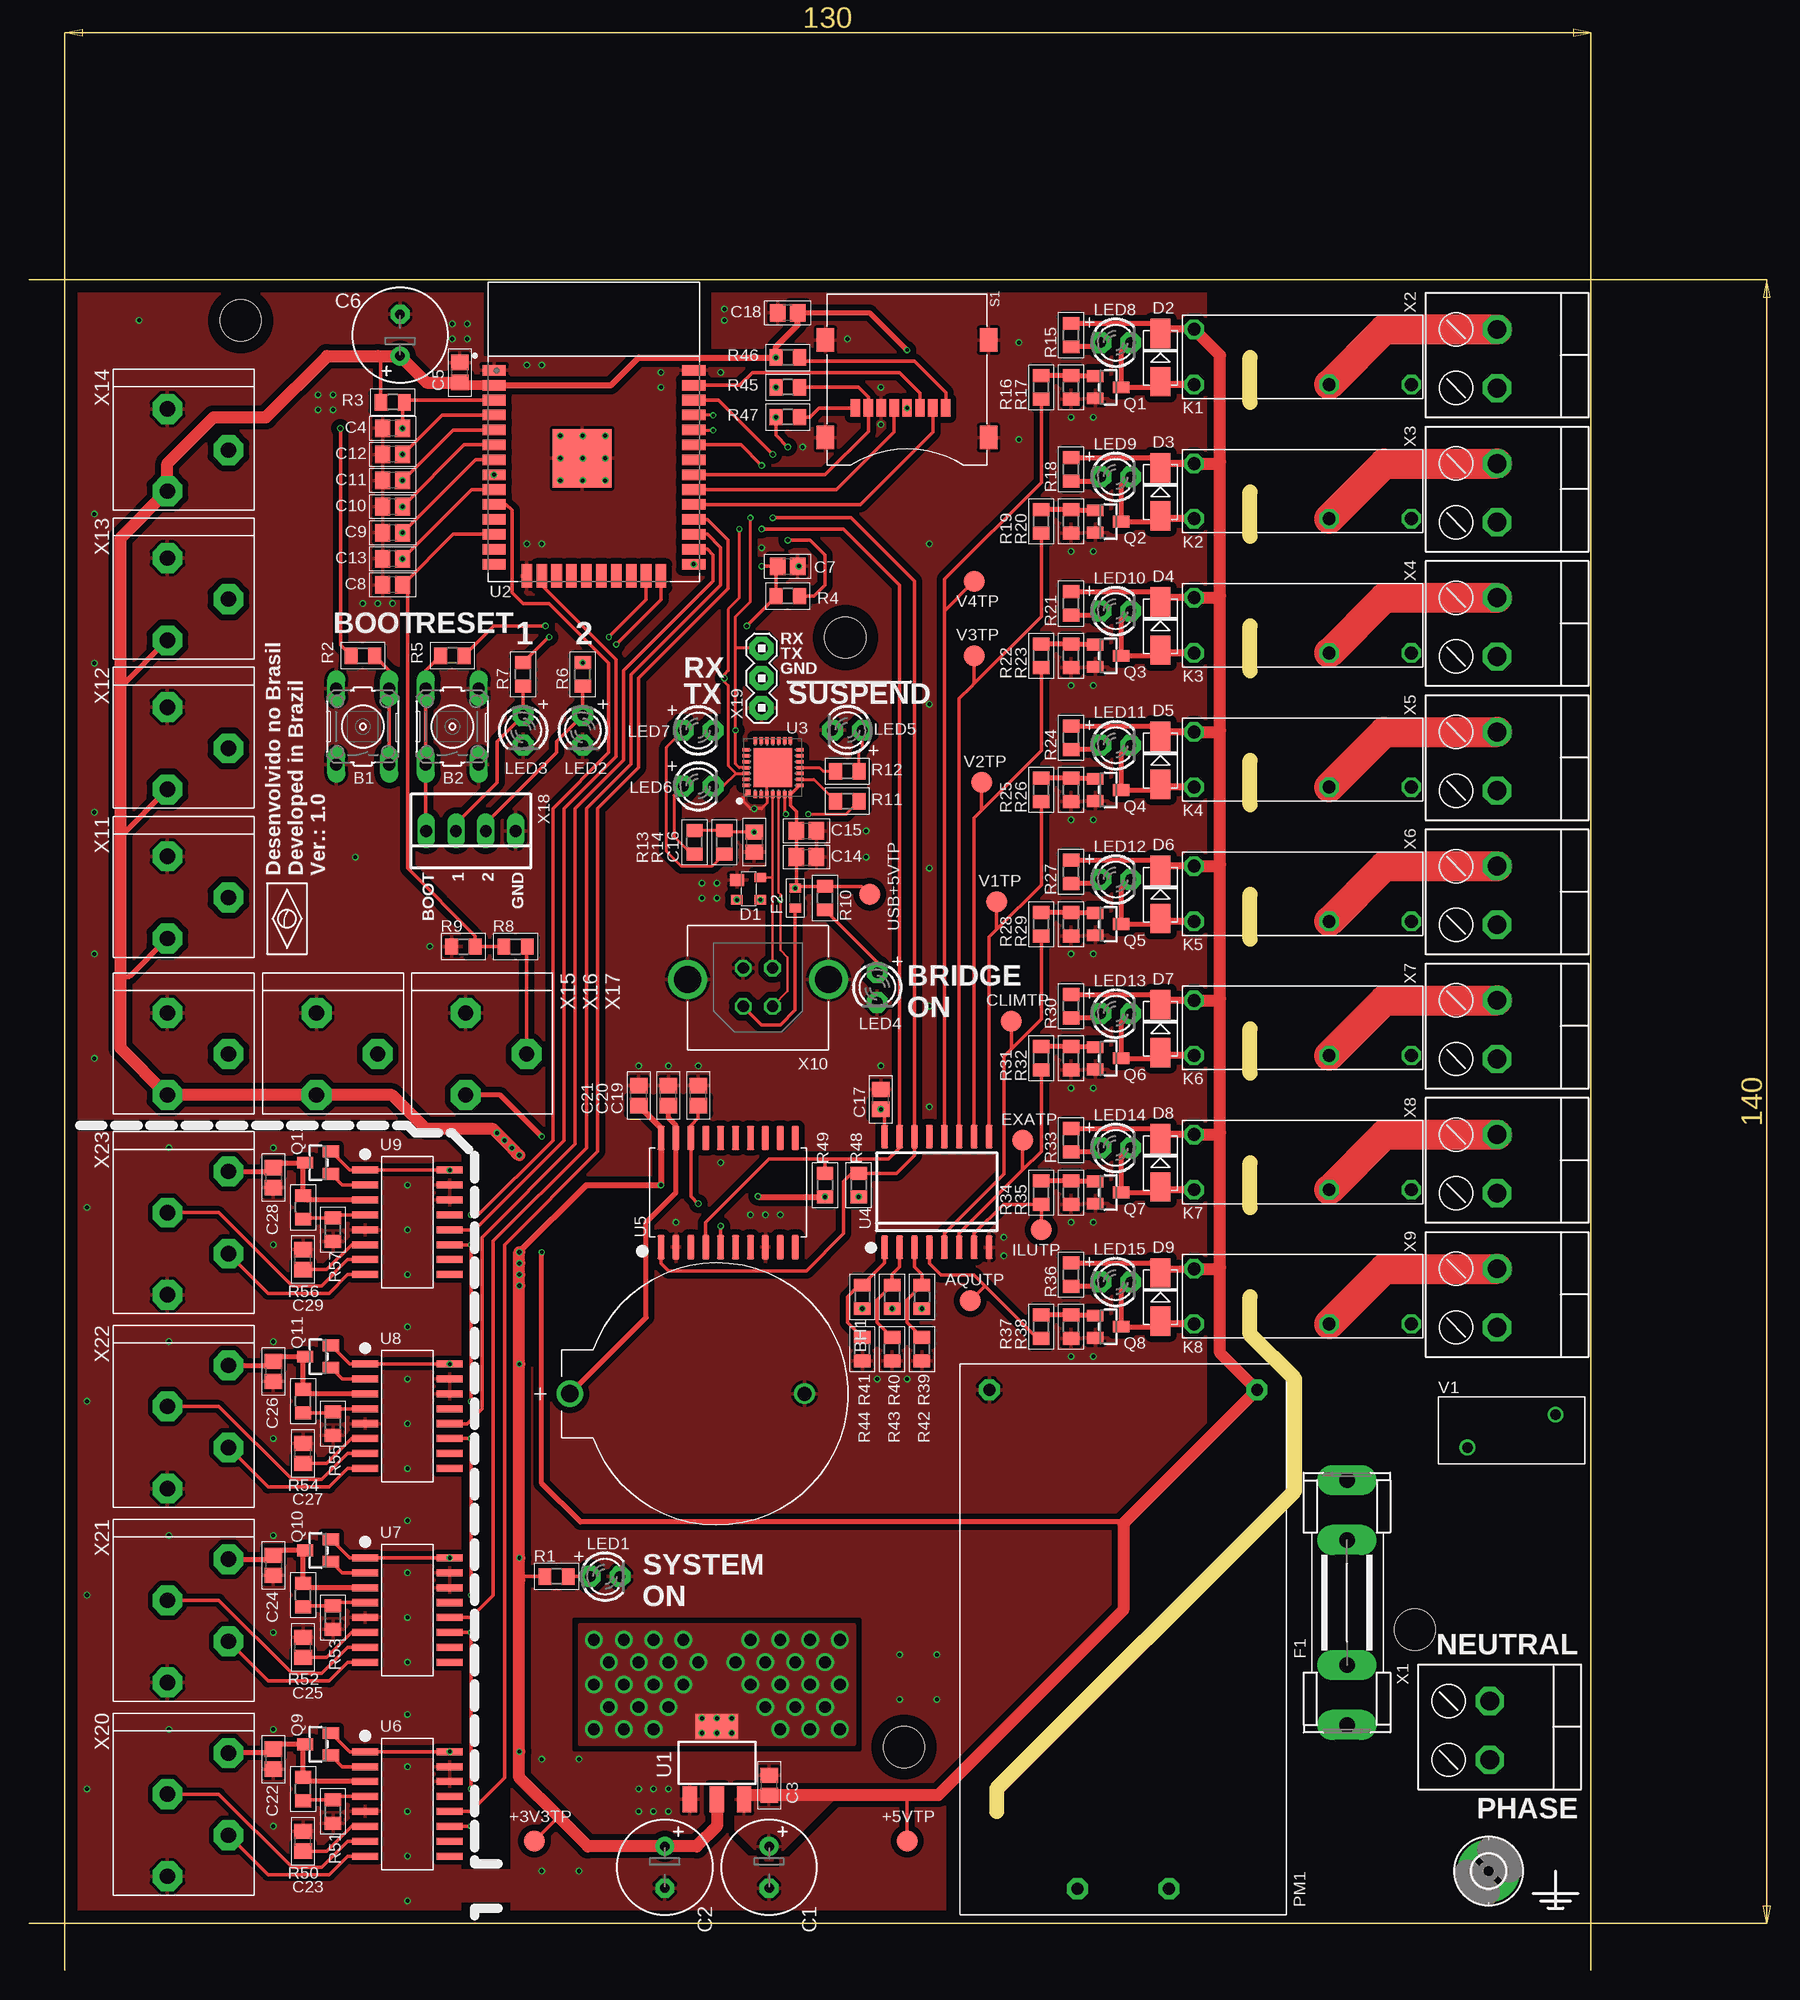
[diagram p6: board, top side]
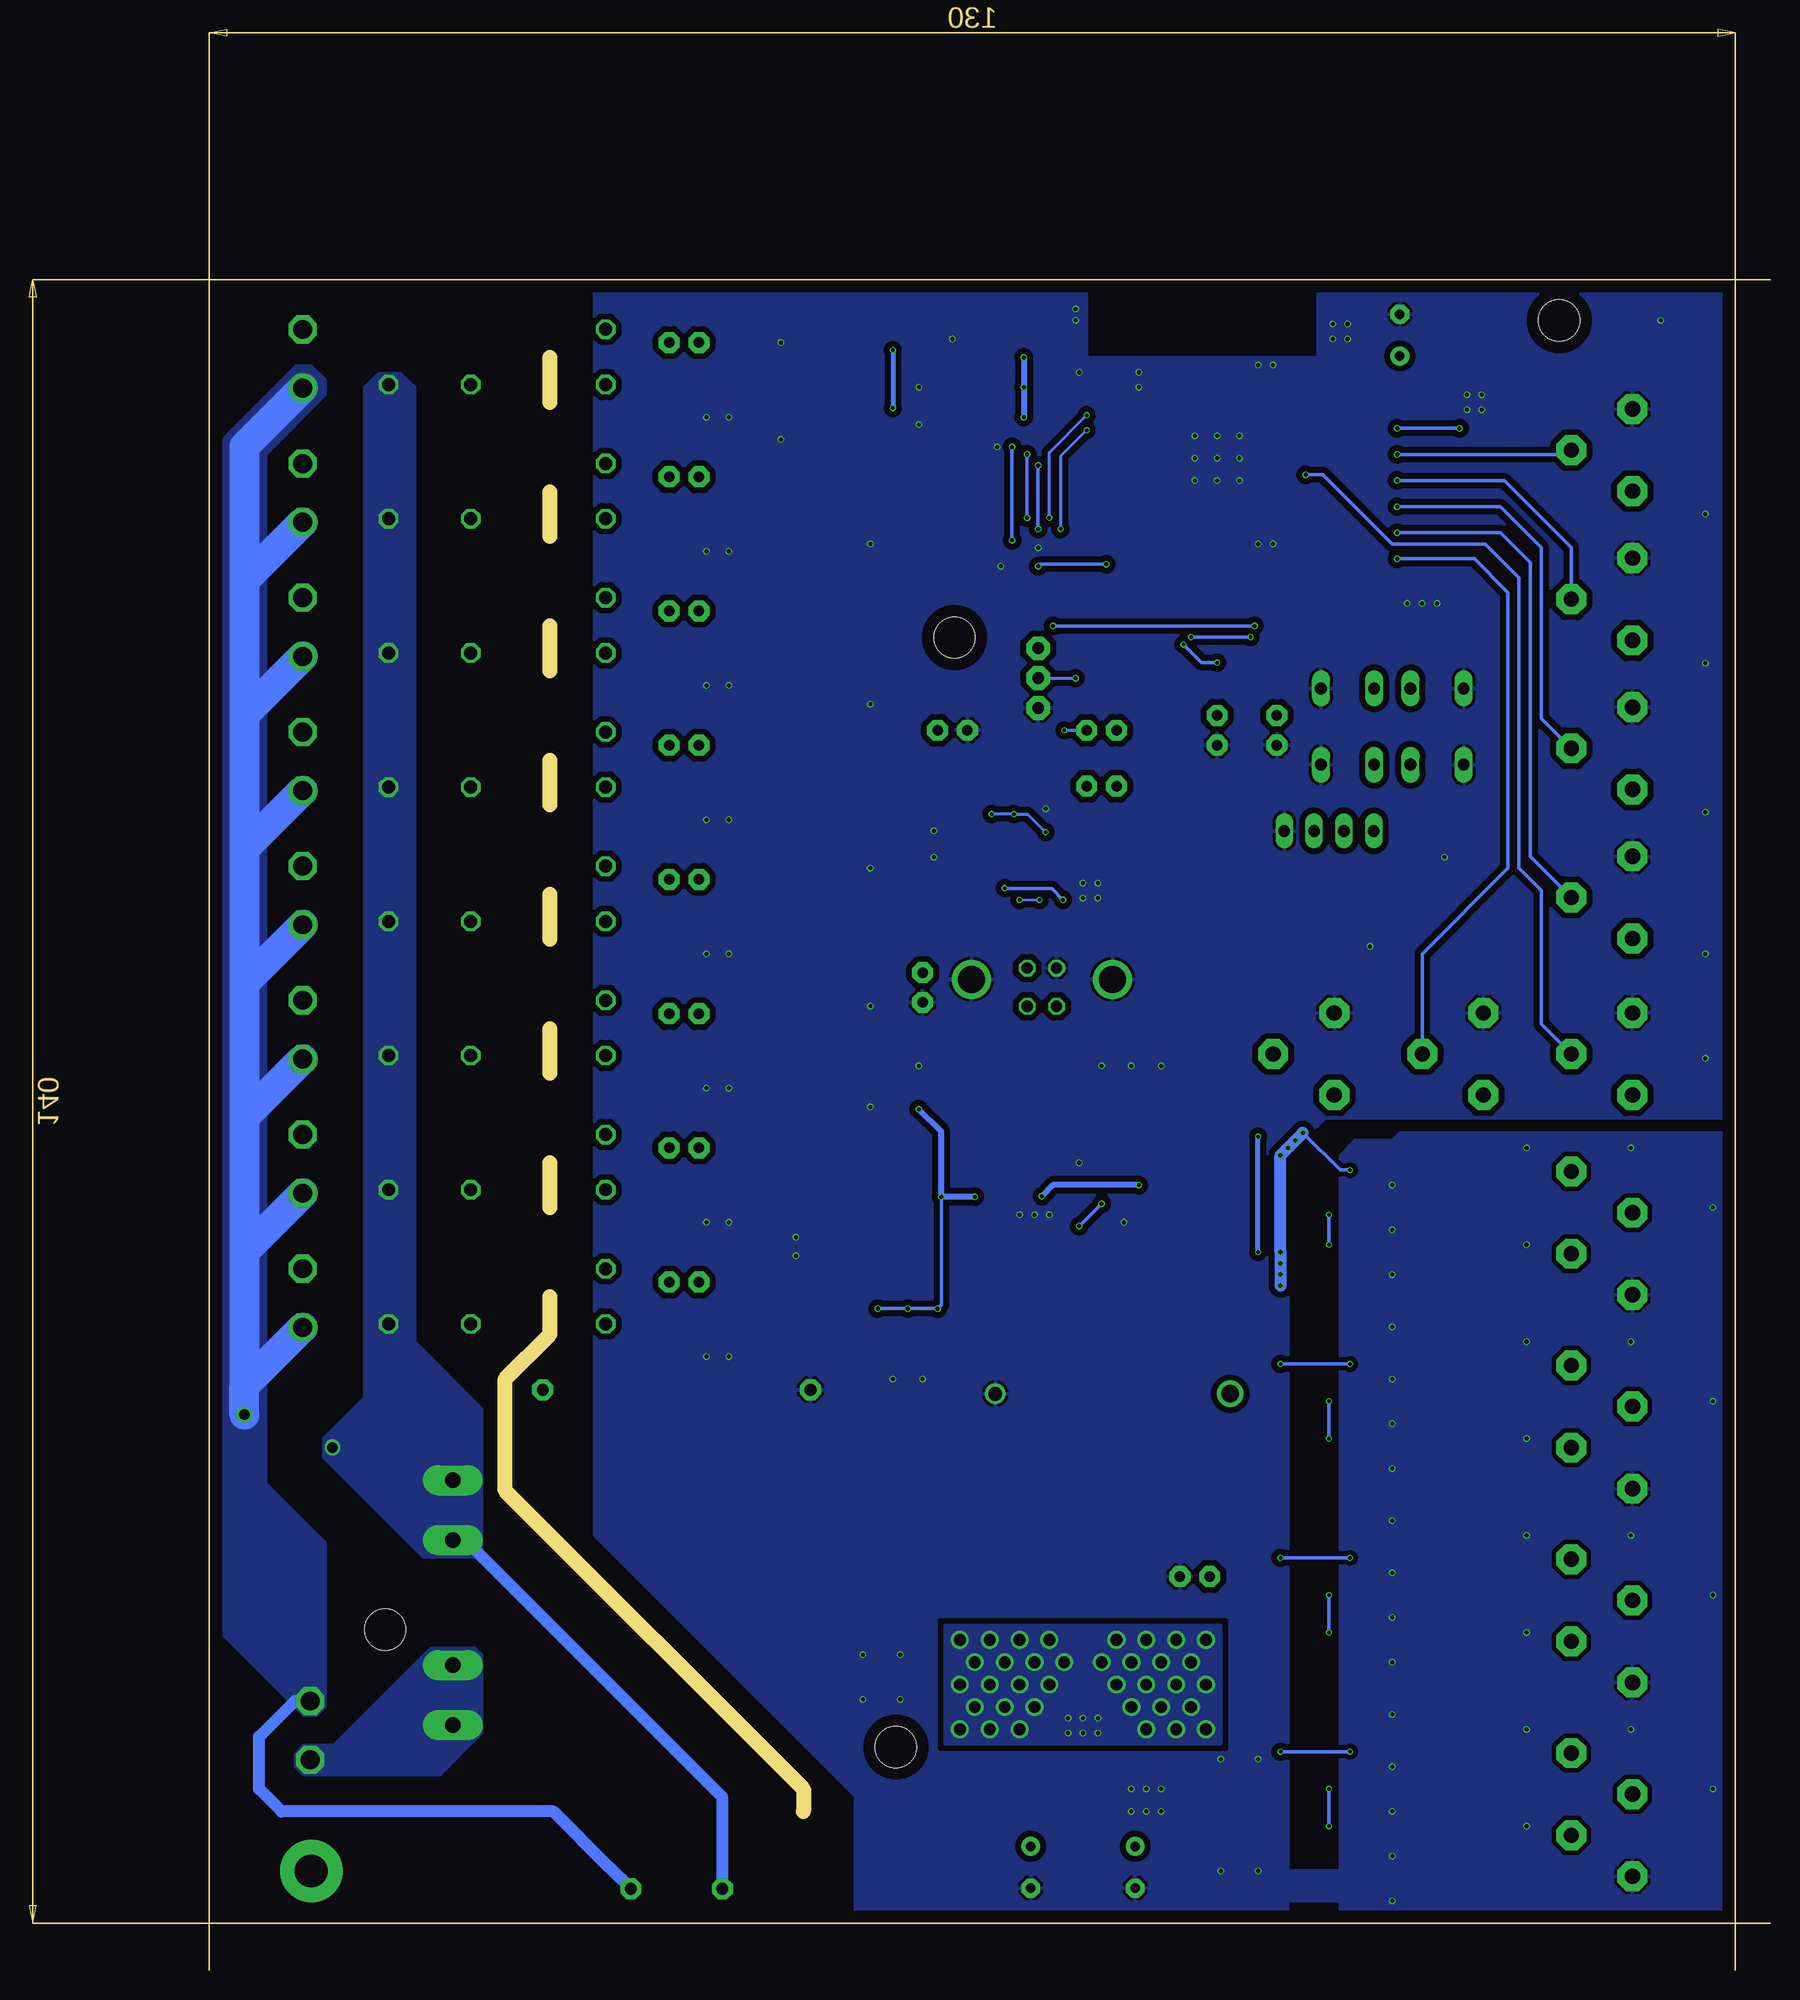
[diagram p7: board, bottom side, seen from below]

Size 130 x 140 mm. Coordinates in mm from the lower left corner, seen from the top.
Outline: 0,0 130,0 130,140 0,140 0,0
Copper layers (1*16): Top 0.035mm / dielectric 1.5mm / Bottom 0.035mm
Design rules "daniel": minimum track width 3.5mil, minimum drill 0.25mm, track to track 3.5mil, track to pad 5mil, pad to pad 5mil, via to via 5mil, smd to smd 5mil, copper to edge 40mil, drill to drill 6mil, minimum pad ring 4mil, minimum via ring 4mil, stop-mask expansion 4mil, vias tented up to drill 0mil, thermal gap 10mil
Holes 3.5 mm at 15,136.5 66.5,109.5 71.5,15 115,25
tKeepout: area 112.8,22.8 to 117.2,27.2; area 69.2,12.8 to 73.8,17.2; area 64.2,107.2 to 68.8,111.8; area 12.8,134.2 to 17.2,138.8
Milling: 12 lines

### Footprints (pad centres in the part's own frame; a part is rotated, then mirrored left to right if it is on the bottom)
TP18R = smd 1.8 x 1.8: TP 0,0
B3F-10XX = drill 1.016 long: 1 -3.251,2.261; 2 3.251,2.261; 3 -3.251,-2.261; 4 3.251,-2.261
BAT_BS-7 = drill 1.5: + 10,0 | drill 1.17: - -10,0
E3,5-8 = drill 0.813 pad 1.6: + -1.778,0 | drill 0.813 pad 1.6 octagon: - 1.778,0
C0805 = smd 1.3 x 1.5: 1 -0.85,0; 2 0.85,0
SOT-143 = smd 1 x 1.2: 1 -0.75,-1 | smd 0.8 x 1: 2 0.95,-1; 3 -0.95,1; 4 0.95,1
SMA = smd 2.5 x 1.7: A 2.06,0; C -2.04,0
SHK20L = drill 1.321 pad 2.54 long: 1A -10.414,0; 1B -5.334,0; 2A 10.414,0; 2B 5.334,0
C0603 = smd 0.8 x 1: 1 -0.85,0; 2 0.85,0
2,8-PAD = drill 2.8 pad 5.334: B2,8 0,0
RC-105 = drill 1.1 octagon: C1 -9.2,2.4; C2 -9.2,-2.3; P 2.3,-2.3; S 9.3,-2.3
LED3MM = drill 0.889 pad 1.778 octagon: A -1.27,0; K 1.27,0
HLK-10M = drill 1 pad 1.778 octagon: 1 -21.2,3.9; 2 -21.2,-3.9; 3 21.3,11.4; 4 21.3,-11.4
SOT23 = smd 1 x 1.4: 1 -0.95,-1.1; 2 0.95,-1.1; 3 0,1.1
R0805 = smd 1.1 x 1.4: 1 -1,0; 2 1,0
TF-002T-15 = smd 0.8 x 1.5: CS 2.2,-2.4; GND -2.2,-2.4; MISO -3.3,-2.4; MOSI 1.1,-2.4; RES@1 3.3,-2.4; RES@2 -4.4,-2.4; SCK -1.1,-2.4; VDD 0,-2.4 | smd 1.5 x 2: PAD@1 -6.95,-4.9; PAD@2 -6.95,3.4; PAD@3 6.95,3.4; PAD@4 6.95,-4.9
SOT223 = smd 1.219 x 2.235: 1 -2.311,-3.099; 2 0,-3.099; 3 2.311,-3.099 | smd 3.6 x 2.2: 4 0,3.099
MODULE_ESP32-WROOM = smd 2 x 0.9: 1 -8.5,5.26; 2 -8.5,3.99; 3 -8.5,2.72; 4 -8.5,1.45; 5 -8.5,0.18; 6 -8.5,-1.09; 7 -8.5,-2.36; 8 -8.5,-3.63; 9 -8.5,-4.9; 10 -8.5,-6.17; 11 -8.5,-7.44; 12 -8.5,-8.71; 13 -8.5,-9.98; 14 -8.5,-11.25; 25 8.5,-11.25; 26 8.5,-9.98; 27 8.5,-8.71; 28 8.5,-7.44; 29 8.5,-6.17; 30 8.5,-4.9; 31 8.5,-3.63; 32 8.5,-2.36; 33 8.5,-1.09; 34 8.5,0.18; 35 8.5,1.45; 36 8.5,2.72; 37 8.5,3.99; 38 8.5,5.26 | smd 0.9 x 2: 15 -5.715,-12.25; 16 -4.445,-12.25; 17 -3.175,-12.25; 18 -1.905,-12.25; 19 -0.635,-12.25; 20 0.635,-12.25; 21 1.905,-12.25; 22 3.175,-12.25; 23 4.445,-12.25; 24 5.715,-12.25 | smd 5 x 5: 39 -1,-2.24
MLP28 = smd 0.6 x 0.3: 1 -2.3,1.5; 2 -2.3,1; 3 -2.3,0.5; 4 -2.3,0; 5 -2.3,-0.5; 6 -2.3,-1; 7 -2.3,-1.5; 15 2.3,-1.5; 16 2.3,-1; 17 2.3,-0.5; 18 2.3,0; 19 2.3,0.5; 20 2.3,1; 21 2.3,1.5 | smd 0.3 x 0.6: 8 -1.5,-2.3; 9 -1,-2.3; 10 -0.5,-2.3; 11 0,-2.3; 12 0.5,-2.3; 13 1,-2.3; 14 1.5,-2.3; 22 1.5,2.3; 23 1,2.3; 24 0.5,2.3; 25 0,2.3; 26 -0.5,2.3; 27 -1,2.3; 28 -1.5,2.3 | smd 3.3 x 3.3: EXP 0,0 | smd 0.435 x 0.435: M -2.103,2.103
SOIC16_W = smd 0.6 x 2: 1 -4.445,-4.662; 2 -3.175,-4.662; 3 -1.905,-4.662; 4 -0.635,-4.662; 5 0.635,-4.662; 6 1.905,-4.662; 7 3.175,-4.662; 8 4.445,-4.662; 9 4.445,4.763; 10 3.175,4.763; 11 1.905,4.763; 12 0.635,4.763; 13 -0.635,4.763; 14 -1.905,4.763; 15 -3.175,4.763; 16 -4.445,4.763
SOIC127P1032X264-20N = smd 2.05 x 0.6: 1 -4.65,5.715; 2 -4.65,4.445; 3 -4.65,3.175; 4 -4.65,1.905; 5 -4.65,0.635; 6 -4.65,-0.635; 7 -4.65,-1.905; 8 -4.65,-3.175; 9 -4.65,-4.445; 10 -4.65,-5.715; 11 4.65,-5.715; 12 4.65,-4.445; 13 4.65,-3.175; 14 4.65,-1.905; 15 4.65,-0.635; 16 4.65,0.635; 17 4.65,1.905; 18 4.65,3.175; 19 4.65,4.445; 20 4.65,5.715
SOP16 = smd 0.6 x 2.2: 1 -4.445,-3.6; 2 -3.175,-3.6; 3 -1.905,-3.6; 4 -0.635,-3.6; 5 0.635,-3.6; 6 1.905,-3.6; 7 3.175,-3.6; 8 4.445,-3.6; 9 4.445,3.6; 10 3.175,3.6; 11 1.905,3.6; 12 0.635,3.6; 13 -0.635,3.6; 14 -1.905,3.6; 15 -3.175,3.6; 16 -4.445,3.6
10D561K = drill 0.9: 1 -3.7,-1.4; 2 3.8,1.4
BR1002V = drill 1.6 octagon: 1 -2.4,0.1; 2 2.6,0.1
USB-TYPEB-V = drill 0.95 octagon: D+ -1.25,-1.65; D- -1.25,1.6; GND 1.25,-1.65; VCC 1.25,1.6 | drill 2.3: GND@1 -6,-0.7; GND@2 6,-0.7
TE_1-2834011-3 = drill 1.3 pad 2.54 octagon: 1 4.4,-1.4; 2 0.9,3.8; 3 -2.6,-1.4
22-23-2041 = drill 1 long: 1 -3.81,0; 2 -1.27,0; 3 1.27,0; 4 3.81,0
1X3 = drill 1.016 pad 2.032 octagon: 1 0,0; 2 2.54,0; 3 5.08,0
TE_1-2834011-4 = drill 1.3 pad 2.54 octagon: 1 4.9,-1.4; 2 1.4,3.8; 3 -2.1,-1.4; 4 -5.6,3.8

### Placement (x,y rotation side)
+3V3TP  40.01,6.99 0 top
+5VTP  71.75,6.99 0 top
AQUTP  77.15,53.02 0 top
B1  25.4,101.92 90 top
B2  33.02,101.92 90 top
BH1  53.02,45.09 180 top
C1  60.01,4.76 270 top
C2  51.12,4.76 270 top
C3  60.01,11.75 90 top
C4  27.94,127.32 180 top
C5  33.66,132.08 90 top
C6  28.57,135.25 90 top
C7  61.59,115.57 0 top
C8  27.94,113.98 180 top
C9  27.94,118.43 180 top
C10  27.94,120.65 180 top
C11  27.94,122.87 180 top
C12  27.94,125.09 180 top
C13  27.94,116.2 180 top
C14  63.18,90.81 0 top
C15  63.18,93.03 0 top
C16  58.74,92.08 270 top
C17  69.53,70.17 90 top
C18  61.59,137.16 180 top
C19  53.98,70.48 90 top
C20  51.44,70.48 90 top
C21  48.9,70.48 90 top
C22  17.78,13.97 270 top
C23  20.32,6.99 90 top
C24  17.78,30.48 270 top
C25  20.32,23.5 90 top
C26  17.78,46.99 270 top
C27  20.32,40.01 90 top
C28  17.78,63.5 270 top
C29  20.32,56.52 90 top
CLIMTP  80.64,76.83 0 top
D1  58.26,88.11 270 top
D2  93.34,133.35 270 top
D3  93.34,121.92 270 top
D4  93.34,110.49 270 top
D5  93.34,99.06 270 top
D6  93.34,87.63 270 top
D7  93.34,76.2 270 top
D8  93.34,64.77 270 top
D9  93.34,53.34 270 top
EXATP  81.6,66.67 0 top
F1  109.22,27.3 90 top
F2  62.23,87.31 90 top
H1  121.28,4.45 0 top
ILUTP  83.19,59.05 0 top
K1  105.41,133.35 0 top
K2  105.41,121.92 0 top
K3  105.41,110.49 0 top
K4  105.41,99.06 0 top
K5  105.41,87.63 0 top
K6  105.41,76.2 0 top
K7  105.41,64.77 0 top
K8  105.41,53.34 0 top
LED1  46.04,29.53 0 top
LED2  44.13,101.6 270 top
LED3  39.05,101.6 270 top
LED4  69.22,79.69 270 top
LED5  66.67,101.6 180 top
LED6  53.98,96.84 0 top
LED7  53.98,101.6 0 top
LED8  89.53,134.62 0 top
LED9  89.53,123.19 0 top
LED10  89.53,111.76 0 top
LED11  89.53,100.33 0 top
LED12  89.53,88.9 0 top
LED13  89.53,77.47 0 top
LED14  89.53,66.04 0 top
LED15  89.53,54.61 0 top
LOGO1  20.95,82.55 90 top
PM1  90.17,24.13 90 top
Q1  88.9,130.81 270 top
Q2  88.9,119.38 270 top
Q3  88.9,107.95 270 top
Q4  88.9,96.52 270 top
Q5  88.9,85.09 270 top
Q6  88.9,73.66 270 top
Q7  88.9,62.23 270 top
Q8  88.9,50.8 270 top
Q9  21.59,15.24 90 top
Q10  21.59,31.75 90 top
Q11  21.59,48.26 90 top
Q12  21.59,64.77 90 top
R1  41.91,29.53 180 top
R2  25.4,107.95 0 top
R3  27.94,129.54 180 top
R4  61.59,113.03 180 top
R5  33.02,107.95 180 top
R6  44.13,106.36 90 top
R7  39.05,106.36 90 top
R8  38.42,83.19 0 top
R9  33.97,83.19 0 top
R10  64.77,87.31 90 top
R11  66.67,95.57 0 top
R12  66.67,98.11 180 top
R13  53.66,92.08 90 top
R14  56.2,92.08 90 top
R15  85.72,135.25 90 top
R16  83.19,130.81 90 top
R17  85.72,130.81 90 top
R18  85.72,123.83 90 top
R19  83.19,119.38 90 top
R20  85.72,119.38 90 top
R21  85.72,112.39 90 top
R22  83.19,107.95 90 top
R23  85.72,107.95 90 top
R24  85.72,100.97 90 top
R25  83.19,96.52 90 top
R26  85.72,96.52 90 top
R27  85.72,89.53 90 top
R28  83.19,85.09 90 top
R29  85.72,85.09 90 top
R30  85.72,78.11 90 top
R31  83.19,73.66 90 top
R32  85.72,73.66 90 top
R33  85.72,66.67 90 top
R34  83.19,62.23 90 top
R35  85.72,62.23 90 top
R36  85.72,55.24 90 top
R37  83.19,50.8 90 top
R38  85.72,50.8 90 top
R39  73.03,53.34 270 top
R40  70.48,53.34 270 top
R41  67.94,53.34 270 top
R42  73.03,48.9 90 top
R43  70.48,48.9 90 top
R44  67.94,48.9 90 top
R45  61.59,130.81 180 top
R46  61.59,133.35 180 top
R47  61.59,128.27 180 top
R48  67.63,62.87 270 top
R49  64.77,62.87 270 top
R50  20.32,11.43 90 top
R51  22.86,9.53 90 top
R52  20.32,27.94 90 top
R53  22.86,26.04 90 top
R54  20.32,44.45 90 top
R55  22.86,42.55 90 top
R56  20.32,60.96 90 top
R57  22.86,59.05 90 top
S1  71.75,131.44 0 top
U1  55.56,13.65 0 top
U2  45.09,127 0 top
U3  60.33,98.42 90 top
U4  74.3,62.23 0 top
U5  56.52,62.23 90 top
U6  29.21,10.16 270 top
U7  29.21,26.67 270 top
U8  29.21,43.18 270 top
U9  29.21,59.69 270 top
USB+5VTP  68.58,87.63 0 top
V1  123.19,41.91 0 top
V1TP  79.38,87 0 top
V2TP  78.11,97.16 0 top
V3TP  77.47,107.95 0 top
V4TP  77.47,114.3 0 top
X1  121.28,16.51 270 top
X2  121.92,133.35 270 top
X3  121.92,121.92 270 top
X4  121.92,110.49 270 top
X5  121.92,99.06 270 top
X6  121.92,87.63 270 top
X7  121.92,76.2 270 top
X8  121.92,64.77 270 top
X9  121.92,53.34 270 top
X10  59.05,79.69 180 top
X11  10.16,88.27 270 top
X12  10.16,100.97 270 top
X13  10.16,113.67 270 top
X14  10.16,126.36 270 top
X15  10.16,74.93 270 top
X16  22.86,74.93 270 top
X17  35.56,74.93 270 top
X18  34.61,93.03 180 top
X19  59.37,103.5 90 top
X20  10.16,8.89 270 top
X21  10.16,25.4 270 top
X22  10.16,41.91 270 top
X23  10.16,58.42 270 top

### Tracks (layer width: path | path; a pad name or v marks a point on that pad's centre or on a via)
+3V3  (via drill 0.3, 0.35)
  Top 0.305: U4.16 69.85,69 C17.1 | Q10.2 24.27,31.11 U7.1 v32.81,31.11 | Q11.2 24.27,47.62 U8.1 U8.16 | Q12.2 24.27,64.14 U9.1 v32.81,64.14 | R47.2 60.59,126.73 v61.59,125.73 | v61.59,117.79 63.5,117.79 64.77,116.52 64.77,113.98 63.82,113.03 R4.1 | U6.16 U6.1 24.27,14.61 Q9.2 | R3.2 26.94,133.21 26.67,133.48 | R1.2 39.05,29.53 38.73,29.21 | +3V3TP.TP 42.07,9.05
  Top 0.406: C18.1 68.58,137.16 v71.75,133.99 | X11.1 5.54,80.64 4.76,80.64 | X12.1 4.76,92.57 4.76,92.08 | X13.1 4.76,105.27 4.76,104.78
  Top 0.508: C21.1 50.8,67.73 U5.20 v50.8,62.87 44.45,62.87 v38.73,57.15 | v59.05,61.91 59.1,61.87 R49.2 | U2.2 46.53,130.99 48.9,133.35 R46.2 60.59,134.25 62.45,136.1 C18.1
  Top 0.813: U2.2 33.9,130.99 C5.1
  Top 1.016: U1.2 55.56,8.26 53.85,6.54 C2.+ 44.58,6.54 42.07,9.05 38.73,12.38 v38.73,14.61 38.73,29.21 v38.73,31.11 v38.73,47.62 v38.73,54.29 v38.73,55.24 v38.73,56.2 v38.73,57.15 | v38.73,65.41 v38.1,66.04 v37.47,66.67 v36.83,67.31 36.51,67.63 30.8,67.63 27.89,70.53 X16.1 X15.1 4.76,74.53 4.76,80.64 4.76,92.08 4.76,104.78 4.76,117.97 X14.1 8.76,124.33 12.7,128.27 17.14,128.27 22.35,133.48 26.67,133.48 C6.+ 30.82,131.23 C5.1
  Bottom 0.305: v61.59,125.73 v61.59,117.79 | R48.2 67.63,52.66 R41.2 R40.2 R39.2 | U6.16 v38.73,14.61 | v32.81,31.11 v38.73,31.11 | U8.16 v38.73,47.62 | v32.81,64.14 33.66,64.14 v36.83,67.31
  Bottom 0.406: v71.75,133.99 S1.VDD
  Bottom 0.508: v50.8,62.87 58.1,62.87 v59.05,61.91 | R49.2 R48.2 67.63,67.41 C17.1 | R46.2 R45.2 R47.2
  Bottom 1.016: v38.73,54.29 v38.73,55.24 v38.73,56.2 v38.73,57.15 v38.73,65.41 v38.1,66.04 v37.47,66.67 v36.83,67.31
  other vias: 64.77,61.87 67.63,61.87 69.53,69.32 67.94,52.34 70.48,52.34 73.03,52.34 60.59,133.35 60.59,130.81 60.59,128.27 71.75,129.04 32.81,14.61 32.81,47.62
+5V  (via drill 0.3)
  Top 0.305: +5VTP.TP 71.75,10.79 71.86,10.9
  Top 0.406: R36.2 92.48,56.24 D9.C | R33.2 92.48,67.67 D8.C | R30.2 92.48,79.11 D7.C | R27.2 92.48,90.53 D6.C | R24.2 92.48,101.97 D5.C | R21.2 92.48,113.39 D4.C | R18.2 92.48,124.83 D3.C | R15.2 92.48,136.25 D2.C | 90.3,34.16 43.95,34.16 40.64,37.47 v40.64,57.15 | v40.64,66.99 37.1,70.53 X17.1
  Top 0.61: D9.C 93.7,55.74 K8.C1 | K7.C1 93.7,67.17 D8.C | K6.C1 93.7,78.6 D7.C | K5.C1 93.7,90.03 D6.C | K4.C1 93.7,101.46 D5.C | K3.C1 93.7,112.89 D4.C | K2.C1 93.7,124.32 D3.C | K1.C1 93.7,135.75 D2.C
  Top 1.016: K1.C1 98.42,133.53 98.42,124.46 | 98.42,55.88 98.42,48.58 PM1.4 90.3,34.16 90.17,34.03 90.17,26.67 74.4,10.9 71.86,10.9 C3.1 58.22,10.9 U1.3 | 98.42,55.88 98.42,67.31 | 98.42,67.31 98.42,78.74 | 98.42,78.74 98.42,90.17 | 98.42,90.17 98.42,101.6 | 98.42,101.6 98.42,113.03 | 98.42,113.03 98.42,124.46 | K2.C1 98.28,124.32 98.42,124.46 | K3.C1 98.28,112.89 98.42,113.03 | K4.C1 98.28,101.46 98.42,101.6 | K5.C1 98.28,90.03 98.42,90.17 | K6.C1 98.28,78.6 98.42,78.74 | K7.C1 98.28,67.17 98.42,67.31 | K8.C1 98.28,55.74 98.42,55.88
  Bottom 0.406: v40.64,57.15 v40.64,66.99
  pour Top (isolate 0.406): 59.69,5.4 60.33,5.4 66.04,11.11 57.15,11.11 57.15,7.94
AQUECEDOR
  Top 0.305: R37.1 82.87,49.8 78.4,54.27 | 78.4,54.27 77.47,55.2 74.66,55.2 73.66,56.2 U4.4 | AQUTP.TP 78.4,54.27
AVDD_1
  Top 0.406: U6.3 20.68,12.06 R50.2 20.32,15.07 Q9.3 18.2,15.24 C22.1 17.45,14.49 X20.4
AVDD_2
  Top 0.406: U7.3 20.68,28.57 R52.2 20.32,31.58 Q10.3 18.2,31.75 C24.1 17.45,31 X21.4
AVDD_3
  Top 0.406: U8.3 20.68,45.09 R54.2 20.32,48.09 Q11.3 18.2,48.26 C26.1 17.45,47.51 X22.4
AVDD_4
  Top 0.406: U9.3 20.68,61.59 R56.2 20.32,64.6 Q12.3 18.2,64.77 C28.1 17.45,64.02 X23.4
BBS  (via drill 0.35)
  Top 0.305: U5.5 v55.88,59.37 | v53.98,61.28 53.34,61.91 U5.18 53.34,67.94 53.98,68.58 C19.1
  Bottom 0.305: v55.88,59.37 v53.98,61.28
BOOT
  Top 0.305: X18.4 30.76,93.07 B2.1 B2.2 30.76,106.69 R5.2
CLIMATIZADOR
  Top 0.305: U4.5 74.93,58.74 80.01,63.82 80.01,73.82 80.57,74.37 80.64,74.45 | 80.64,74.45 83.19,76.99 R28.1 | CLIMTP.TP 80.64,74.45
DOUT_1
  Top 0.305: U6.12 34.61,9.53 37.47,12.38 37.47,57.78 45.4,65.72 45.4,94.93 48.9,98.42 48.9,106.05 56.52,113.67 56.52,117.79 54.75,119.56 U2.28
DOUT_2
  Top 0.305: U7.12 34.61,26.04 36.51,27.94 36.51,58.1 44.45,66.04 44.45,94.93 48.26,98.74 48.26,106.36 55.88,113.98 55.88,117.16 54.75,118.29 U2.27
DOUT_3
  Top 0.305: U8.12 34.29,42.55 35.56,43.81 35.56,58.42 43.5,66.36 43.5,94.93 47.62,99.06 47.62,106.68 55.24,114.3 55.24,116.52 54.75,117.02 U2.26
DOUT_4
  Top 0.305: U9.12 34.92,59.05 42.55,66.67 42.55,94.93 46.99,99.38 46.99,107.63 40.64,113.98 U2.16
EXAUSTOR
  Top 0.305: U4.6 76.2,58.74 81.6,64.14 | 81.6,64.14 83.19,65.72 R31.1 | EXATP.TP 81.6,64.14
F
  Bottom 1.016: PM1.1 86.27,10.71 108.2,32.64 F1.2B
  pour Bottom (isolate 0.406, no thermals): 106.68,43.81 106.68,31.75 107.31,31.11 111.76,31.11 120.33,39.69 120.33,41.27 116.84,44.77 116.84,130.81 115.57,132.08 113.67,132.08 112.39,130.81 112.39,49.53
GND  (via drill 0.35)
  Top 0.254: U3.EXP 59.83,97.92 U3.3 59.83,95.39 59.37,94.93 v58.74,94.93 58.42,94.93 57.78,95.57 57.78,95.89 U3.M
  other vias: 1.91,60.96 8.89,66.04 17.78,66.04 17.78,57.78 29.21,62.87 29.21,59.05 29.21,55.24 29.21,50.8 1.91,44.45 8.89,49.53 17.78,49.53 17.78,41.27 29.21,46.35 29.21,42.55 29.21,38.73 29.21,34.29 1.91,27.94 8.89,33.02 17.78,33.02 17.78,24.77 29.21,29.84 29.21,26.04 29.21,22.23 29.21,17.78 1.91,11.43 8.89,16.51 17.78,16.51 17.78,8.26 29.21,13.34 29.21,9.53 29.21,5.71 29.21,1.91 40.64,4.45 40.64,13.97 43.81,13.97 43.81,4.45 74.3,19.05 71.12,22.86 71.12,19.05 74.3,22.86 71.75,46.35 69.22,46.35 60.96,60.33 59.69,60.33 58.42,60.33 55.88,64.77 52.07,59.69 48.9,73.03 51.44,73.03 53.98,73.03 80.01,58.42 80.01,56.83 87.63,48.26 85.72,48.26 87.63,128.27 85.72,128.27 87.63,116.84 85.72,116.84 87.63,105.41 85.72,105.41 87.63,93.98 85.72,93.98 87.63,82.55 85.72,82.55 87.63,71.12 85.72,71.12 87.63,59.69 85.72,59.69 69.53,73.03 54.29,88.58 54.29,87.31 55.56,87.31 55.56,88.58 68.26,90.81 68.26,93.03 69.53,127.64 69.53,130.81 73.66,117.47 73.66,103.82 73.66,89.85 73.66,78.11 73.66,69.53 46.04,122.87 44.13,122.87 42.23,122.87 42.23,124.78 44.13,124.78 46.04,124.78 46.04,126.68 44.13,126.68 42.23,126.68 34.29,134.94 33.02,134.94 33.02,136.21 34.29,136.21 59.37,117.16 62.55,115.57 66.67,134.94 56.2,137.48 56.2,136.53 62.87,125.73 81.28,134.62 81.28,126.36 55.88,132.08 50.8,130.81 50.8,132.08 39.37,117.47 40.64,117.47 39.37,132.72 40.64,132.72 6.35,136.53 2.54,120.02 2.54,107.31 2.54,94.61 2.54,82.55 2.54,73.66 31.11,83.19 24.77,90.81 25.4,112.39 26.67,112.39 27.94,112.39 21.59,128.91 21.59,130.18 22.86,130.18 22.86,128.91 48.9,11.43 50.16,11.43 51.44,11.43 51.44,9.53 50.16,9.53 48.9,9.53
  pour Top (isolate 0.508, rank 6): 0,140.34 0,68.58 29.21,68.58 29.84,67.94 35.56,67.94 38.1,65.41 38.1,4.45 33.02,4.45 33.02,1.91 38.1,1.91 38.1,0 74.93,0 74.93,10.79 97.16,33.02 97.16,140.34 55.24,140.34 55.24,133.35 35.56,133.35 35.56,140.34
  pour Bottom (isolate 0.406, rank 4): 0,0 33.66,0 33.66,65.41 32.38,66.67 29.21,66.67 28.57,67.31 0,67.31
  pour Top (isolate 0.406, rank 4): 0,0 33.66,0 33.66,65.41 32.38,66.67 29.84,66.67 29.21,66.67 28.57,67.31 14.61,67.31 0,67.31
  pour Bottom (isolate 0.508, rank 6): 38.1,0 74.93,0 74.93,10.79 97.16,33.02 97.16,140.34 55.24,140.34 55.24,133.35 35.56,133.35 35.56,140.34 0,140.34 0,68.58 34.92,68.58 38.1,65.41 38.1,4.45 33.02,4.45 33.02,1.91 38.1,1.91
ILUMINACAO
  Top 0.305: U4.7 77.47,58.74 79.96,61.23 R34.1 ILUTP.TP
IN_CO2
  Top 0.305: R8.2 39.36,83.13 X17.2
INA+_1
  Top 0.305: U6.8 24.13,5.71 22.54,4.13 17.32,4.13 X20.2
INA+_2
  Top 0.305: U7.8 24.13,22.23 22.54,20.64 17.32,20.64 X21.2
INA+_3
  Top 0.305: U8.8 24.13,38.73 22.54,37.15 17.32,37.15 X22.2
INA+_4
  Top 0.305: U9.8 24.13,55.24 22.54,53.66 17.32,53.66 X23.2
INA-_1
  Top 0.305: U6.7 24.13,6.99 21.91,4.76 19.37,4.76 13.14,10.99 X20.3
INA-_2
  Top 0.305: U7.7 24.13,23.5 21.91,21.27 19.37,21.27 13.14,27.5 X21.3
INA-_3
  Top 0.305: U8.7 24.13,40.01 21.91,37.78 19.37,37.78 13.14,44.01 X22.3
INA-_4
  Top 0.305: U9.7 24.13,56.52 21.91,54.29 19.37,54.29 13.14,60.52 X23.3
LED_VERDE  (via drill 0.3)
  Top 0.305: v46.99,108.9 50.8,112.71 U2.24
  Bottom 0.305: R6.2 45.45,107.36 v46.99,108.9
  other vias: 44.13,107.36
LED_VERDE_EXT
  Top 0.305: R6.1 LED2.A 41.91,100.65 41.91,99.69 35.88,93.66 X18.2
LED_VERMELHO  (via drill 0.3)
  Top 0.305: R7.2 41.23,109.54 v41.27,109.54 | v46.35,109.54 49.53,112.71 U2.23
  Bottom 0.305: v41.27,109.54 v46.35,109.54
LED_VERMELHO_EXT
  Top 0.305: R7.1 LED3.A 36.83,100.65 36.83,97.16 33.34,93.66 X18.3
MISO
  Top 0.305: U2.31 64.79,123.37 68.45,127.03 S1.MISO 68.45,129.98 67.63,130.81 R45.1
MOSI
  Top 0.305: U2.37 57.49,130.99 58.58,132.08 71.12,132.08 72.87,130.33 72.86,130.32 S1.MOSI
N
  Bottom 1.016: PM1.2 95.9,4.76 100.67,9.53 123.83,9.53 125.73,11.43 125.73,15.88 122.69,18.91 X1.1
  Bottom 2.54: X2.2 127,125.77 127,114.34 | 127,114.34 127,102.91 | 127,102.91 127,91.48 | 127,91.48 127,80.05 | 127,80.05 127,68.62 | 127,68.62 127,57.19 | 127,57.19 127,45.76 | X9.2 127,45.76 | X8.2 127,57.19 | X7.2 127,68.62 | X6.2 127,80.05 | X5.2 127,91.48 | X4.2 127,102.91 | X3.2 127,114.34 | V1.2 127,45.76
  pour Bottom (isolate 0.406, no thermals): 120.02,32.38 120.02,18.41 120.81,17.62 121.92,17.62 128.91,24.61 128.91,126.36 122.56,132.72 121.28,132.72 120.02,131.44 120.02,130.18 125.09,125.09 125.09,37.47
N$1
  pour Bottom (isolate 0.406, no thermals): 121.92,12.54 110.33,12.54 106.68,16.19 106.68,22.86 107.31,23.5 111.12,23.5 119.38,15.24 121.92,15.24 122.71,14.45 122.71,13.34
N$2
  Top 0.406: D2.A 92.86,130.81 Q1.3 90,133.81 LED8.K
  Top 0.61: K1.C2 93.58,131.05 D2.A
N$3
  Top 0.406: LED8.A 87.9,134.25 R15.1
N$4
  Top 0.406: Q1.1 85.78,131.76 R17.2 R16.2
N$5  (via drill 0.35)
  Top 0.305: U2.3 29.12,129.72 R3.1 28.79,129.39 C4.1 | v23.5,127.32 23.5,108.86 R2.1
  Bottom 0.305: C4.1 v23.5,127.32
  other vias: 28.79,127.32
N$6
  Top 2.54: K8.P 112.41,55.74 X9.1
N$7
  Top 0.406: D3.A 92.86,119.38 Q2.3 90,122.39 LED9.K
  Top 0.61: K2.C2 93.58,119.62 D3.A
N$8
  Top 0.406: Q2.1 85.78,120.33 R20.2 R19.2
N$9
  Top 0.406: R18.1 87.9,122.83 LED9.A
N$10
  Top 2.54: K1.P 112.41,135.75 X2.1
N$11
  Top 0.305: B1.3 B1.4 27.66,106.69 R2.2
N$12
  Top 0.406: D4.A 92.86,107.95 Q3.3 90,110.95 LED10.K
  Top 0.61: K3.C2 93.58,108.19 D4.A
N$13
  Top 0.406: Q3.1 85.78,108.9 R23.2 R22.2
N$14
  Top 0.406: R21.1 87.9,111.39 LED10.A
N$15  (via drill 0.35)
  Top 0.305: R5.1 36.56,110.49 v40.96,110.49 | v58.1,110.49 60.59,112.98 R4.2 60.59,115.42 C7.1 v59.37,115.57
  Bottom 0.305: v40.96,110.49 v58.1,110.49 | U2.25 59.19,115.75 v59.37,115.57
  other vias: 53.59,115.75
N$16
  Top 2.54: K2.P 112.41,124.32 X3.1
N$17
  Top 0.406: D5.A 92.86,96.52 Q4.3 90,99.53 LED11.K
  Top 0.61: K4.C2 93.58,96.76 D5.A
N$18
  Top 0.406: Q4.1 85.78,97.47 R26.2 R25.2
N$19
  Top 0.406: LED11.A 87.9,99.97 R24.1
N$20
  Top 2.54: K3.P 112.41,112.89 X4.1
N$21  (via drill 0.3, 0.35)
  Top 0.305: U3.8 U3.7 61.83,95.18 62.33,94.67 C15.1 C14.1 62.33,88.27 F2.2 62.38,88.31 R10.2 67.9,88.31 USB+5VTP.TP
  Bottom 0.305: F2.2 62.17,88.11 58.21,88.11 D1.2
  other vias: 62.23,88.16 57.26,87.16
N$22
  Top 0.406: D6.A 92.86,85.09 Q5.3 90,88.09 LED12.K
  Top 0.61: K5.C2 93.58,85.33 D6.A
N$23
  Top 0.406: Q5.1 85.78,86.04 R29.2 R28.2
N$24
  Top 0.406: LED12.A 87.9,88.53 R27.1
N$25
  Top 2.54: K4.P 112.41,101.46 X5.1
N$26
  Top 0.305: U6.2 23.64,13.34 Q9.1
N$27
  Top 0.406: 93.58,73.9 93.34,73.66 Q6.3 90,76.67 LED13.K
  Top 0.61: K6.C2 93.58,73.9 D7.A
N$28
  Top 0.406: Q6.1 85.78,74.61 R32.2 R31.2
N$29
  Top 0.406: LED13.A 87.9,77.11 R30.1
N$30
  Top 0.305: R10.1 69.22,81.87 LED4.A
N$31
  Top 2.54: K5.P 112.41,90.03 X6.1
N$32
  Top 0.406: D8.A 92.86,62.23 Q7.3 90,65.23 LED14.K
  Top 0.61: K7.C2 93.58,62.47 D8.A
N$33
  Top 0.406: Q7.1 85.78,63.18 R35.2 R34.2
N$34
  Top 0.406: LED14.A 87.9,65.67 R33.1
N$35
  Top 2.54: K6.P 112.41,78.6 X7.1
N$36
  Top 0.305: X10.VCC 59.38,76.52 60.96,76.52 62.23,77.79 F2.1
N$37
  Top 0.406: D9.A 92.86,50.8 Q8.3 90,53.8 LED15.K
  Top 0.61: K8.C2 93.58,51.04 D9.A
N$38
  Top 0.406: Q8.1 85.78,51.75 R38.2 R37.2
N$39
  Top 0.406: LED15.A 87.9,54.24 R36.1
N$40
  Top 2.54: K7.P 112.41,67.17 X8.1
N$41
  Top 0.305: U6.4 23.13,10.79 R51.2 20.41,10.53 R50.1
N$42
  Top 0.254: U3.9 63.82,97.42 R11.1
N$43
  Top 0.203: X10.D+ 60.3,89.06 | 60.3,89.06 60.3,96.11 U3.4 | D1.3 60.3,89.06
N$46  (via drill 0.3)
  Top 0.203: X10.D- 61.59,79.38 61.59,82.23 60.96,82.87 v60.96,87.15 60.96,87.63 60.8,87.79 60.8,96.1
  Top 0.254: 60.8,96.1 U3.5
  Bottom 0.203: v60.96,87.15 v60.96,87.16 D1.4
  other vias: 59.26,87.16
N$49
  Top 0.254: LED6.A 51.91,96.04 51.91,92.55 53.39,91.08 R13.1
N$50
  Top 0.305: R1.1 LED1.A
N$51
  Top 0.305: R46.1 62.91,133.03 72.39,133.03 75.06,130.37 S1.RES@1
N$52
  Top 0.254: R14.1 55.13,90.01 52.55,90.01 51.28,91.28 51.28,100.17 LED7.A
N$53
  Top 0.254: R12.1 67.67,99.74 67.94,100.01 LED5.A
N$54
  Top 0.254: U3.11 64.29,98.42 64.61,98.11 R12.2
N$55
  Top 0.305: R47.1 63.5,128.27 64.28,129.04 S1.RES@2
N$56
  Top 0.406: C20.1 51.44,68.58 52.07,67.94 U5.19 52.07,62.23 49.53,59.69 49.53,51.59 BH1.+
N$58
  Top 0.305: U4.1 69.85,56.24 R41.1 67.67,54.34 66.67,53.34 66.67,51.16 R44.2
N$59
  Top 0.305: U4.2 71.12,55.88 70.48,55.24 R40.1 69.22,53.07 69.22,51.16 R43.2
N$60
  Top 0.305: U4.3 72.39,55.88 73.03,55.24 R39.1 71.75,53.07 71.75,51.16 R42.2
N$64
  Top 0.305: U7.2 23.64,29.84 Q10.1
N$66
  Top 0.305: C23.1 22.33,6.13 24.45,8.26 U6.6
N$67
  Top 0.305: U7.4 23.13,27.3 R53.2 20.41,27.04 R52.1
N$74
  Top 0.305: C25.1 22.33,22.64 24.45,24.77 U7.6
N$75
  Top 0.305: U8.2 23.64,46.35 Q11.1
N$77
  Top 0.305: R54.1 22.77,43.45 R55.2 23.13,43.81 U8.4
N$84
  Top 0.305: C27.1 22.33,39.16 24.45,41.27 U8.6
N$85
  Top 0.305: U9.2 23.64,62.87 Q12.1
N$87
  Top 0.305: R56.1 20.41,60.05 R57.2 23.13,60.33 U9.4
N$94
  Top 0.305: C29.1 22.33,55.66 24.45,57.78 U9.6
OUT_CO2
  Top 0.305: U2.12 33.1,118.29 C8.1 29.21,113.56 29.21,89.85 34.97,84.09 R9.2 R8.1
PD_SCK  (via drill 0.3)
  Top 0.305: U2.10 37.6,120.83 38.1,120.33 38.1,113.35 39.05,112.39 41.27,112.39 46.35,107.31 46.35,99.69 41.59,94.93 41.59,66.67 35.24,60.33 v34.61,60.33 | v34.61,44.45 v34.61,57.78 U9.11 | v34.61,27.94 v34.61,41.27 U8.11 | v34.61,11.43 v34.61,24.77 U7.11 | v34.61,8.26 U6.11
  Bottom 0.305: v34.61,60.33 v34.61,57.78 | v34.61,44.45 v34.61,41.27 | v34.61,27.94 v34.61,24.77 | v34.61,11.43 v34.61,8.26
RXD  (via drill 0.3)
  Top 0.254: U3.25 57.47,98.42 57.15,98.74 v57.15,101.6 57.15,108.58 | v58.42,119.7 58.42,112.55 57.15,111.28 57.15,108.58 | v55.24,128.43 55.22,128.45 U2.35 | X19.3 57.15,108.58
  Bottom 0.254: v58.42,119.7 58.42,125.25 v55.24,128.43 | v57.15,101.6 LED7.K
SCK
  Top 0.305: U2.30 65.74,122.1 70.66,127.01 S1.SCK
SCL  (via drill 0.35)
  Top 0.305: U2.36 55.7,129.72 v60.33,125.09 | v60.33,119.7 66.99,119.7 72.39,114.3 U4.14 72.39,65.41 70.85,63.87 R48.1 67.04,63.87 66.36,63.18 66.36,58.74 63.18,55.56 51.44,55.56 50.8,56.2 U5.1
  Bottom 0.305: v60.33,125.09 v60.33,119.7
SD_CS
  Top 0.305: U2.29 67.81,120.83 73.95,126.98 S1.CS
SDA  (via drill 0.35)
  Top 0.305: v59.37,124.14 57.6,125.91 U2.33 | v59.37,118.75 66.36,118.75 71.12,113.98 U4.15 71.12,66.04 70.17,65.09 64.77,65.09 | U5.4 54.61,59.69 60.01,65.09 64.77,65.09 | R49.1 64.77,65.09
  Bottom 0.305: v59.37,124.14 v59.37,118.75
SL  (via drill 0.35)
  Top 0.305: C13.1 34.69,122.1 U2.9
  Bottom 0.305: X16.2 26.66,82.56 19.37,89.85 19.37,113.35 22.23,116.2 C13.1
  other vias: 28.79,116.2
STU  (via drill 0.35)
  Bottom 0.305: U2.8 35.1,123.37 29.21,117.47 21.27,117.47 18.41,114.62 18.41,89.85 16.51,87.95 16.51,76.58 X15.2
  other vias: 36.59,123.37
SUS_1  (via drill 0.35)
  Top 0.305: C9.1 35,124.64 U2.7
  Bottom 0.305: X11.2 17.46,90.87 17.46,115.89 20,118.43 C9.1
  other vias: 28.79,118.43
SUS_2  (via drill 0.35)
  Top 0.305: C10.1 34.05,125.91 U2.6
  Bottom 0.305: X12.2 16.51,102.61 16.51,117.16 20,120.65 C10.1
  other vias: 28.79,120.65
SUS_3  (via drill 0.35)
  Top 0.305: C11.1 33.1,127.18 U2.5
  Bottom 0.305: X13.2 13.96,117.15 19.68,122.87 C11.1
  other vias: 28.79,122.87
SUS_4  (via drill 0.35)
  Top 0.305: C12.1 32.15,128.45 U2.4
  Bottom 0.305: X14.2 14.33,125.09 C12.1
  other vias: 28.79,125.09
TH  (via drill 0.35, 1)
  other vias: 47.62,24.13 50.16,24.13 52.7,24.13 58.42,24.13 60.96,24.13 63.5,24.13 62.23,22.23 59.69,22.23 57.15,22.23 53.98,22.23 51.44,22.23 48.9,22.23 47.62,20.32 50.16,20.32 52.7,20.32 58.42,20.32 60.96,20.32 63.5,20.32 62.23,18.41 59.69,18.41 51.44,18.41 48.9,18.41 47.62,16.51 50.16,16.51 60.96,16.51 63.5,16.51 54.29,17.46 55.56,17.46 56.83,17.46 56.83,16.19 55.56,16.19 54.29,16.19 45.09,24.13 46.35,22.23 45.09,20.32 46.35,18.41 45.09,16.51 66.04,24.13 64.77,22.23 66.04,20.32 64.77,18.41 66.04,16.51
  pour Top (isolate 0.406, rank 4, no thermals): 43.81,15.24 67.31,15.24 67.31,25.4 43.81,25.4
  pour Bottom (isolate 0.406, rank 4, no thermals): 43.81,15.24 67.31,15.24 67.31,25.4 43.81,25.4
TXD  (via drill 0.3, 0.35)
  Top 0.254: U2.34 55.22,127.18 v55.24,127.16 | 57.17,97.92 U3.26 | v57.47,118.75 57.47,112.87 56.52,111.92 56.52,106.68 56.2,106.36 v56.2,106.05 56.2,105.73 56.52,105.41 56.52,98.58 57.17,97.92 | 57.17,97.92 56.09,96.84 LED6.K
  Bottom 0.254: v55.24,127.16 57.47,124.94 v57.47,118.75 | X19.2 v56.2,106.05
VALVULA_1
  Top 0.305: 79.38,84.61 83.19,88.42 R25.1 | U4.9 78.74,83.98 79.3,84.53 79.38,84.61 | V1TP.TP 79.38,84.61
VALVULA_2
  Top 0.305: U4.10 77.47,94.14 77.87,94.54 78.11,94.77 | 78.11,94.77 83.19,99.85 R22.1 | V2TP.TP 78.11,94.77
VALVULA_3
  Top 0.305: U4.11 76.2,104.3 77.23,105.33 77.47,105.57 | 77.47,105.57 83.19,111.28 R19.1 | V3TP.TP 77.47,105.57
VALVULA_4
  Top 0.305: U4.12 74.93,111.44 74.93,111.76 | 74.93,111.76 74.93,114.46 83.19,122.71 R16.1 | V4TP.TP 74.93,111.76
VDD  (via drill 0.3)
  Top 0.254: U3.6 61.33,94.57 v61.44,94.46 | C16.1 56.35,92.92 R14.2 R13.2 | R11.2 66.56,94.46 v63.34,94.46
  Bottom 0.254: C16.1 60.27,94.46 v61.44,94.46 v63.34,94.46
  other vias: 58.74,92.92

### Text on the board
tPlace: BOOT | RESET | 1 | 2 | RX | TX | RX | GND | TX | SUSPEND | BOOT | 1 | 2 | GND | Desenvolvido no Brasil / Developed in Brazil | Ver.: 1.0 | BRIDGE / ON | SYSTEM / ON | NEUTRAL | PHASE